# EasyEDA Pro project stm32f103VET6_开发板.eprj, board PCB1
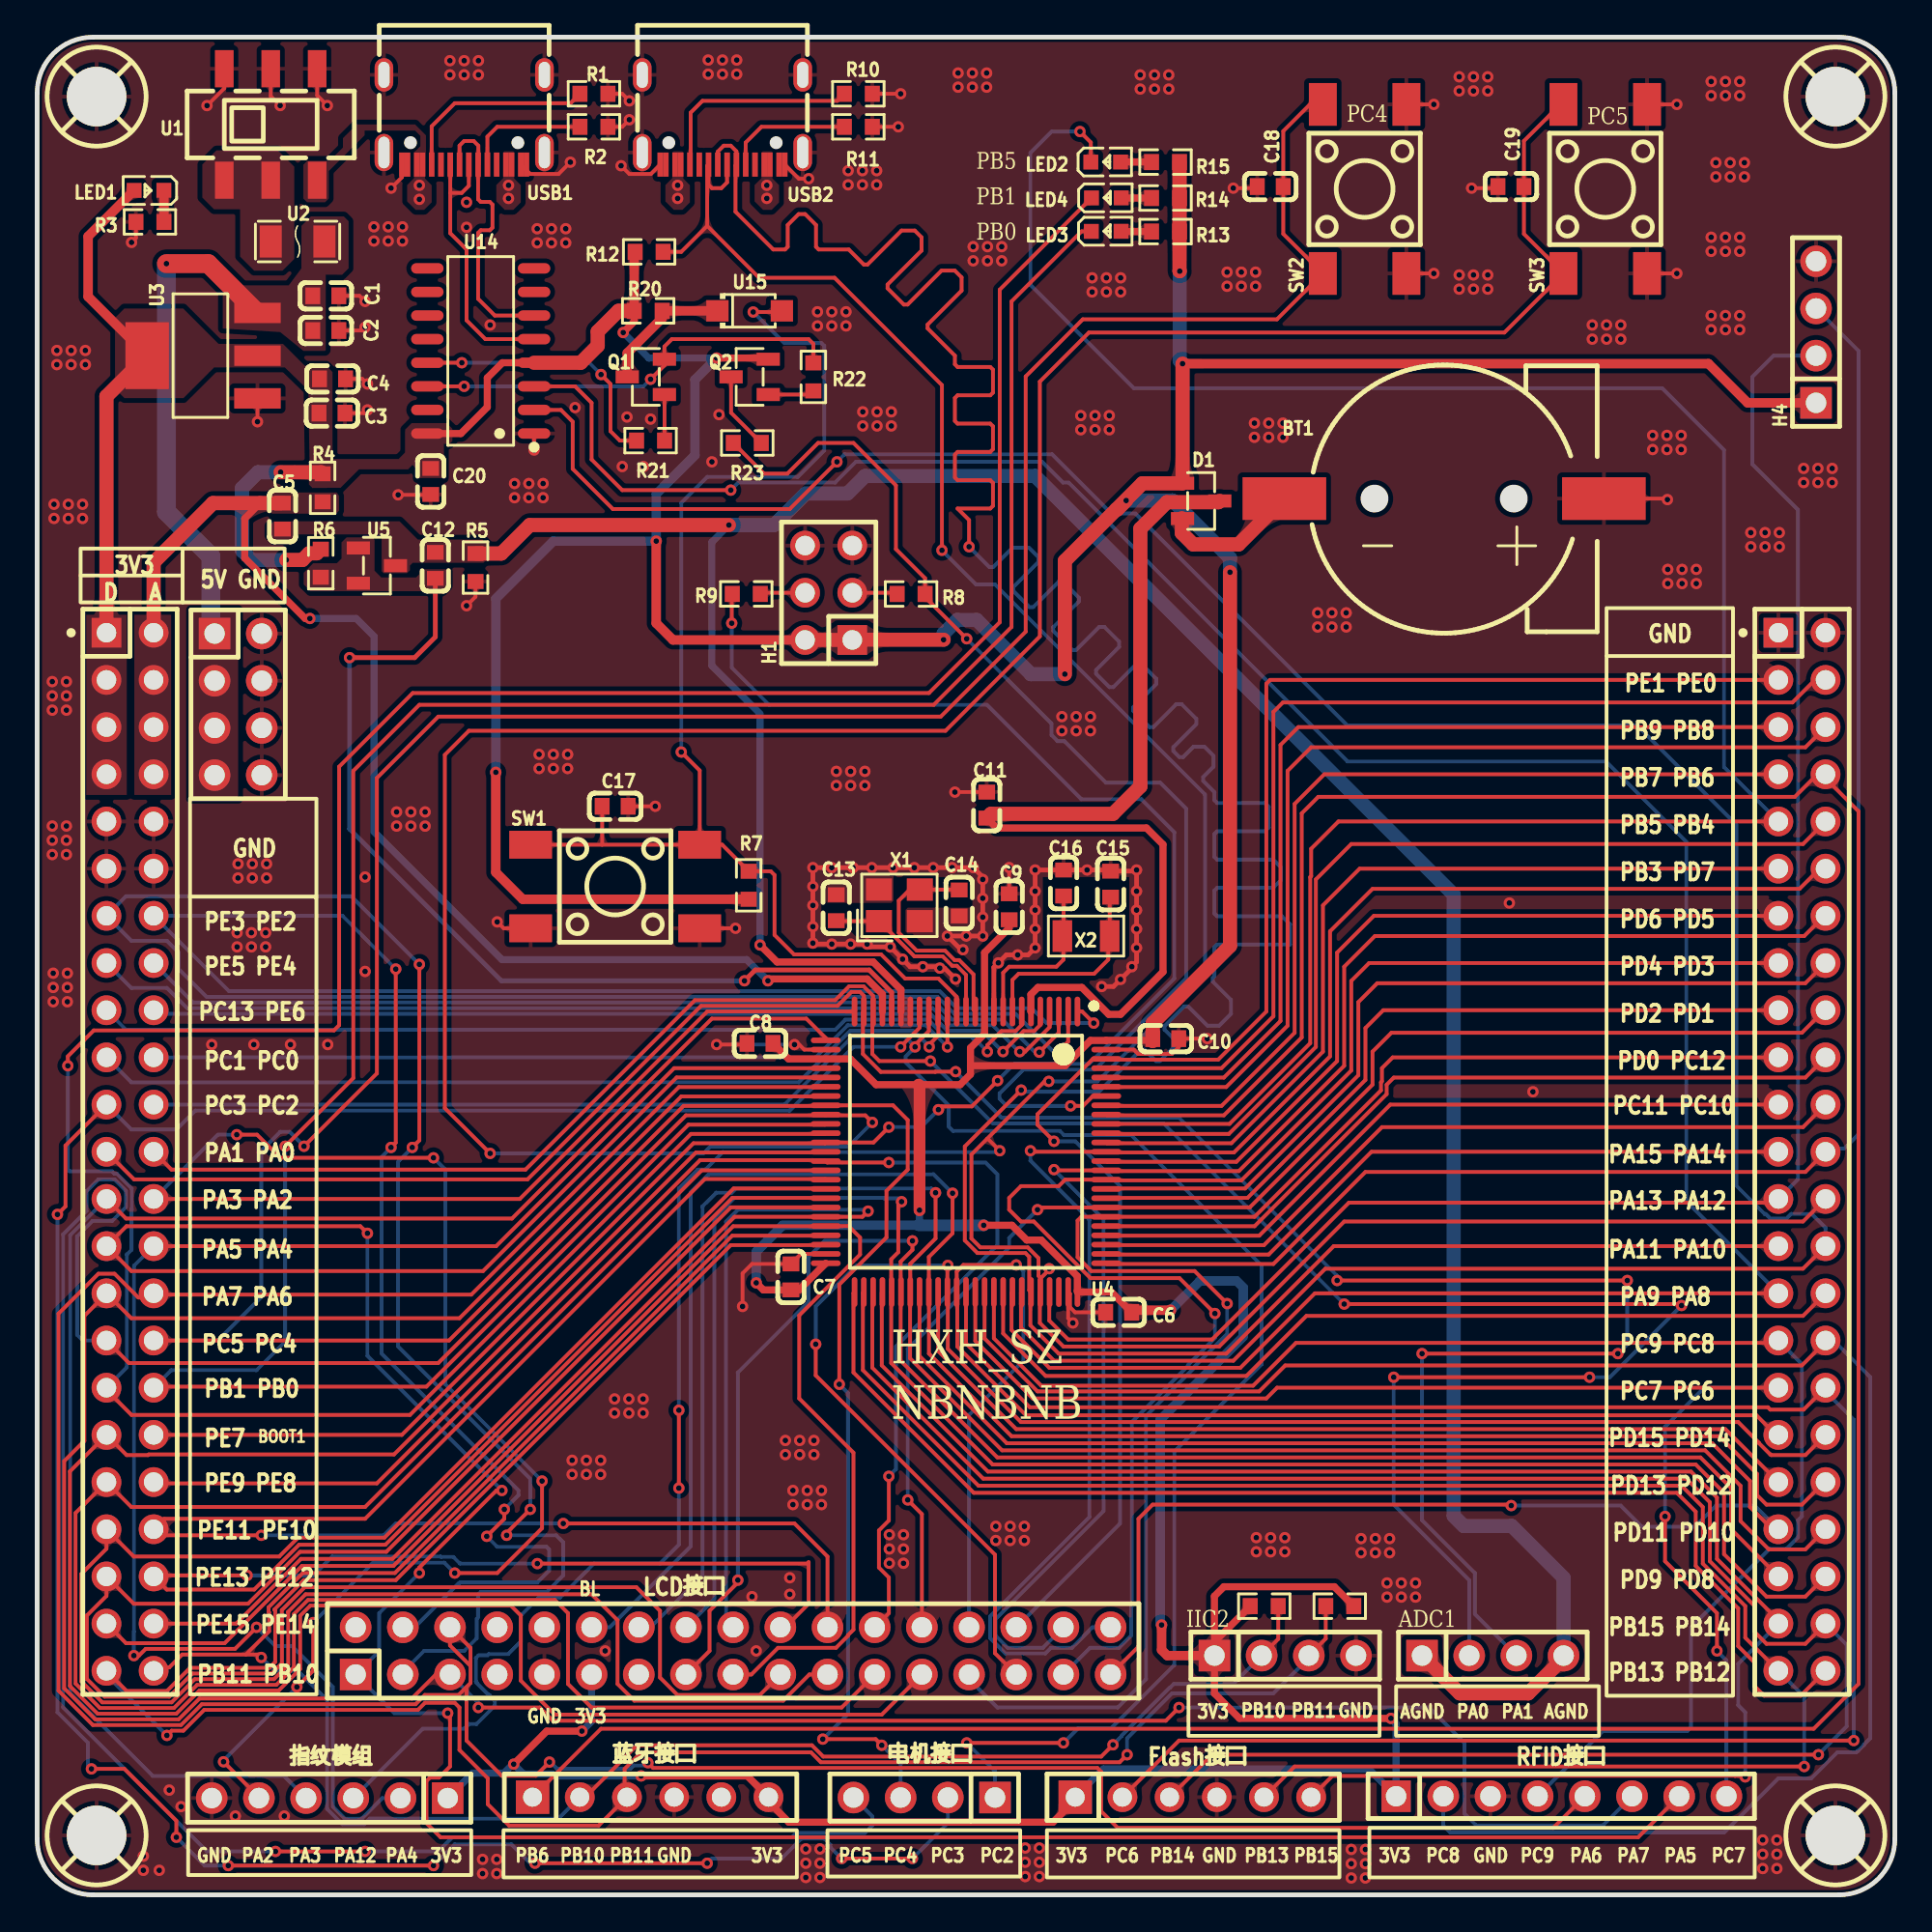
[diagram p3: board, top side]
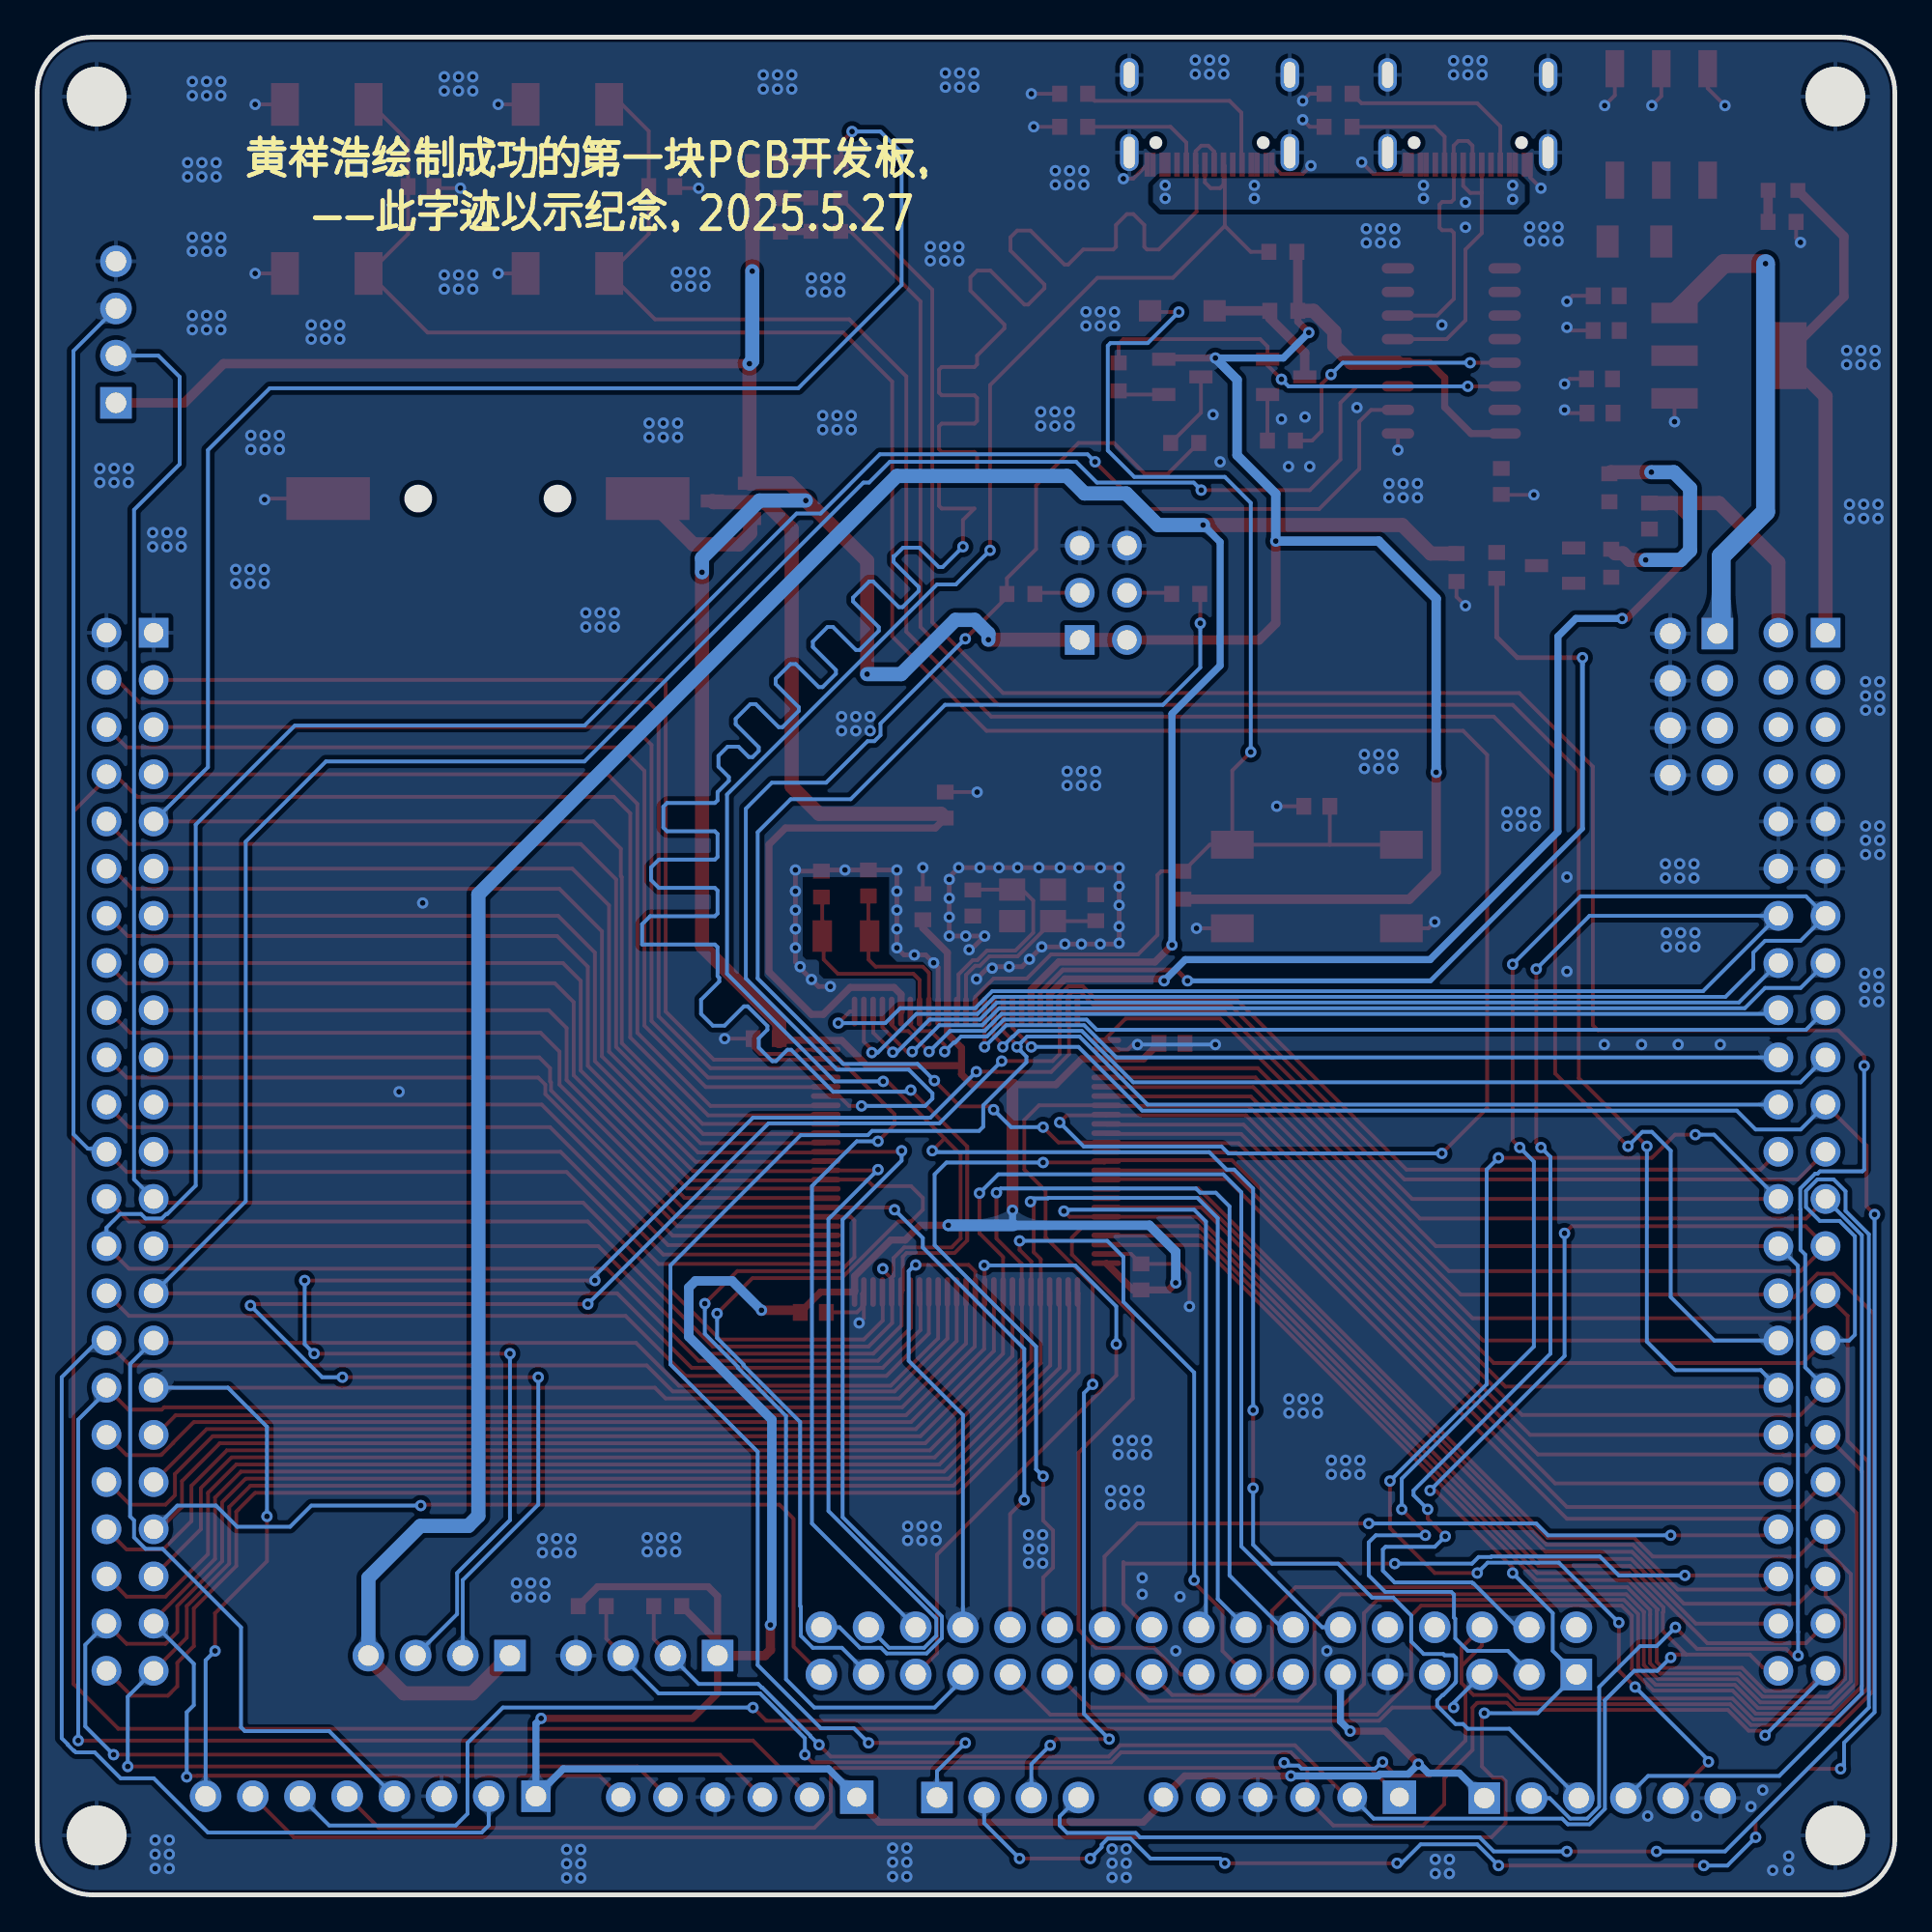
[diagram p4: board, bottom side, seen from below]

Outline 100 x 100 mm; copper layers: Top Layer, Bottom Layer. Coordinates in mm from the lower left corner of the outline.
Outline path: 0,97 0,3 arc(0.88,0.88) 3,0 97,0 arc(99.12,0.88) 100,3 100,97 arc(99.12,99.12) 97,100 3,100 arc(0.88,99.12) 0,97
Stack: Top Layer 0.035mm / Dielectric1 1.51mm FR4 er 4.5 / Bottom Layer 0.035mm

## Design rules (mm)
net PA12: DP2
net PA11: DP2
net DP: DP1
net DN: DP1
template: 自定义配置
spacing copperThickness1oz (default): track to track 0.102, other pairs 0.152 to 0.3
spacing copperThickness2oz: track to track 0.203, other pairs 0.152 to 0.3
track width copperThickness1oz (default): min 0.127, default 0.203, max 2.54
track width copperThickness2oz: min 0.203, default 0.254, max 2.54
differential pair differentialPair (default): width min 0.127, default 0.203, max 2.54; gap min 0.102, default 0.102
via viaSize (default): diameter min 0.5, default 0.61, max 10; hole min 0.3, default 0.305, max 6.3

## Placement (name value [footprint] x y rotation side)
BT1  CR1220-2ZX  [BAT-SMD_CR1220-2ZX]  75.74 75.16 180 top
C1  10uF  [C0603]  15.54 86.08 180 top
C2  100nF  [C0603]  15.54 84.21 180 top
C3  10uF  [C0603]  15.87 79.76 180 top
C4  100nF  [C0603]  15.9 81.6 180 top
C5  100nF  [C0603]  13.21 74.22 90 top
C6  100nF  [C0603]  58.22 31.36 0 top
C7  100nF  [C0603]  40.58 33.26 270 top
C8  100nF  [C0603]  38.91 45.83 0 top
C9  100nF  [C0603]  52.32 53.19 270 top
C10  100nF  [C0603]  60.75 46.09 180 top
C11  100nF  [C0603]  51.12 58.66 90 top
C12  100nF  [C0603]  21.43 71.57 270 top
C13  20pF  [C0603]  43.02 53.14 90 top
C14  20pF  [C0603]  49.63 53.39 90 top
C15  10pF  [C0603]  57.78 54.41 270 top
C16  10pF  [C0603]  55.25 54.47 270 top
C17  100nF  [C0603]  31.12 58.6 180 top
C18  100nF  [C0603]  66.38 91.96 0 top
C19  100nF  [C0603]  79.33 91.96 0 top
C20  100nF  [C0603]  21.19 76.08 270 top
D1  BAT54C  [SOT-23-3_L2.9-W1.3-P1.90-LS2.4-BR]  62.66 75.03 180 top
H1  -  [HDR-TH_6P-P2.54-V-R2-C3-S2.54_A2541WV-2X3P]  42.61 70.09 90 top
H2  X6521WV-2x23H-C60D30  [HDR-TH_46P-2.54-V-M-R2-C23-S2.54]  5 40 270 top
H3  X6521WV-2x23H-C60D30  [HDR-TH_46P-2.54-V-M-R2-C23-S2.54]  95 40 270 top
H4  -  [HDR-TH_4P-P2.54-V-M]  95.76 84.12 90 top
H5  HDR2.54-LI-2x4P  [HDR-TH_4P-P2.54-V-M]  47.75 5.24 180 top
H8  HDR2.54-LI-2x4P  [HDR-TH_4P-P2.54-V-M]  67.18 12.88 0 top
H9  HDR2.54-LI-2x4P  [HDR-TH_4P-P2.54-V-M]  78.36 12.88 0 top
LED1  -  [LED_0603]  5.97 91.75 180 top
LED2  -  [LED_0603]  57.57 93.29 0 top
LED3  -  [LED_0603]  57.6 89.55 0 top
LED4  -  [LED_0603]  57.6 91.35 0 top
P1  2.54-1*6P母  [HDR-TH_6P-P2.54-V-F]  33.02 5.26 0 top
P2  2.54-1*6P母  [HDR-TH_6P-P2.54-V-F]  62.23 5.26 0 top
Q1  S8050  [SOT-23-3_L2.9-W1.3-P1.90-LS2.4-BR]  32.77 81.71 0 top
Q2  S8550  [SOT-23-3_L2.9-W1.3-P1.90-LS2.4-BR]  38.35 81.71 0 top
R1  5.1k  [R0603]  29.97 96.95 0 top
R2  5.1k  [R0603]  29.97 95.17 0 top
R3  2K  [R0603]  6.07 90.05 0 top
R4  0  [R0603]  15.37 75.74 270 top
R5  0  [R0603]  23.6 71.45 90 top
R6  1K  [R0603]  15.27 71.68 270 top
R7  10K  [R0603]  38.3 54.35 90 top
R8  10K  [R0603]  47.04 70.03 180 top
R9  10K  [R0603]  38.17 70.03 180 top
R10  5.1k  [R0603]  44.2 96.95 0 top
R11  5.1k  [R0603]  44.2 95.17 0 top
R12  10K  [R0603]  32.94 88.44 180 top
R13  10K  [R0603]  60.74 89.53 180 top
R14  10K  [R0603]  60.74 91.34 180 top
R15  10K  [R0603]  60.74 93.28 180 top
R18  4.7K  [R0603]  66.06 15.54 180 top
R19  4.7K  [R0603]  70.12 15.54 0 top
R20  10K  [R0603]  32.89 85.27 180 top
R21  1K  [R0603]  33.02 78.28 0 top
R22  1K  [R0603]  41.78 81.71 270 top
R23  1K  [R0603]  38.23 78.16 0 top
SCREW1  -  [M3螺丝]  3.2 96.8 0 top
SCREW2  -  [M3螺丝]  96.8 96.8 0 top
SCREW3  -  [M3螺丝]  96.8 3.2 0 top
SCREW4  -  [M3螺丝]  3.2 3.2 0 top
SW1  -  [SW-SMD_4P-L6.0-W6.0-P4.50-LS9.0-2]  31.12 54.28 0 top
SW2  -  [SW-SMD_4P-L6.0-W6.0-P4.50-LS9.0-2]  71.46 91.83 90 top
SW3  -  [SW-SMD_4P-L6.0-W6.0-P4.50-LS9.0-2]  84.41 91.83 90 top
U1  YSSP2AG00  [SW-SMD_YSSP2AG00]  12.57 95.3 0 top
U2  JK-nSMD005/60V  [F1206]  14.02 89 0 top
U3  AMS1117-3.3  [SOT-223-3_L6.5-W3.4-P2.30-LS7.0-BR]  8.89 82.86 0 top
U4  STM32F103VET6  [LQFP-100_L14.0-W14.0-P0.50-LS16.0-BL]  50 40 180 top
U5  TL431  [SOT-23-3_L2.9-W1.3-P1.90-LS2.4-BR]  18.29 71.55 180 top
U12  双排,C5304剪切后双排2x17P  [HDR-TH_34P-P2.54-V-F-R2-C17-S2.54-1]  37.47 13.13 0 top
U13  B254YP-ZD08P  [HDR-TH_8P-P2.54-V-F]  82.04 5.31 0 top
U14  CH340C  [SOP-16_L10.0-W3.9-P1.27-LS6.0-BL]  23.88 83.11 90 top
U15  1N4007W  [SOD-123FL_L2.7-W1.8-LS3.7-RD]  38.35 85.27 0 top
U16  CS-1109-1*6(L11.5)  [HDR-TH_6P-P2.54-V-M]  15.75 5.21 180 top
U17  GPHA201-0402A001R1AA  [HDR-TH_8P-P2.54-V-M-R2-C4-S2.54]  10.82 64.08 270 top
USB1  HC-TYPE-C-16P-01B  [USB-C-SMD_KH-TYPE-C-16P]  22.99 95.56 180 top
USB2  HC-TYPE-C-16P-01B  [USB-C-SMD_KH-TYPE-C-16P]  36.89 95.56 180 top
X1  XL2EL89CSI-KPIYLC-8M  [CRYSTAL-SMD_4P-L3.2-W2.5-BL]  46.41 53.26 0 top
X2  -  [OSC-SMD_L3.2-W1.5]  56.46 51.61 0 top

## Footprints (pads in the part's own frame, mm; a bottom-side part is the same pattern mirrored in y, then rotated)
BAT-SMD_CR1220-2ZX
  rect 4.5x2.3 smd: 1(-8.6,0) 2(8.6,0)
C0603
  rect 0.8x0.9 smd: 1(-0.7,0) 2(0.7,0)
CRYSTAL-SMD_4P-L3.2-W2.5-BL
  rect 1.4x1.2 smd: 1(-1.1,-0.85) 2(1.1,-0.85) 3(1.1,0.85) 4(-1.1,0.85)
F1206
  rect 1.19x1.728 smd: 1(-1.445,0) 2(1.445,0)
HDR-TH_4P-P2.54-V-M
  rect 1.7x1.7 hole 1.1: 1(-3.81,0)
  round 1.7 hole 1.1: 2(-1.27,0) 3(1.27,0) 4(3.81,0)
HDR-TH_6P-P2.54-V-F
  rect 1.8x1.8 hole 1.02: 1(-6.35,0)
  round 1.6 hole 1.02: 2(-3.81,0) 3(-1.27,0) 4(1.27,0) 5(3.81,0) 6(6.35,0)
HDR-TH_6P-P2.54-V-M
  rect 1.7x1.7 hole 1.1: 1(-6.35,0)
  round 1.7 hole 1.1: 2(-3.81,0) 3(-1.27,0) 4(1.27,0) 5(3.81,0) 6(6.35,0)
HDR-TH_6P-P2.54-V-R2-C3-S2.54_A2541WV-2X3P
  rect 1.6x1.6 hole 1.05: 1(-2.54,-1.27)
  round 1.6 hole 1.05: 2(-2.54,1.27) 3(0,-1.27) 4(0,1.27) 5(2.54,-1.27) 6(2.54,1.27)
HDR-TH_8P-P2.54-V-F
  rect 1.575x1.7 hole 1.1: 1(-8.89,0)
  round 1.7 hole 1.1: 2(-6.35,0) 3(-3.81,0) 4(-1.27,0) 5(1.27,0) 6(3.81,0) 7(6.35,0) 8(8.89,0)
HDR-TH_8P-P2.54-V-M-R2-C4-S2.54
  rect 1.7x1.7 hole 1.1: 1(-3.81,-1.27)
  round 1.7 hole 1.1: 2(-3.81,1.27) 3(-1.27,-1.27) 4(-1.27,1.27) 5(1.27,-1.27) 6(1.27,1.27) 7(3.81,-1.27) 8(3.81,1.27)
HDR-TH_34P-P2.54-V-F-R2-C17-S2.54-1
  rect 1.7x1.7 hole 1.1: 1(-20.32,-1.27)
  round 1.7 hole 1.1: 2(-17.78,-1.27) 3(-15.24,-1.27) 4(-12.7,-1.27) 5(-10.16,-1.27) 6(-7.62,-1.27) 7(-5.08,-1.27) 8(-2.54,-1.27) 9(0,-1.27) 10(2.54,-1.27) 11(5.08,-1.27) 12(7.62,-1.27) 13(10.16,-1.27) 14(12.7,-1.27) 15(15.24,-1.27) 16(17.78,-1.27) 17(20.32,-1.27) 18(20.32,1.27) 19(17.78,1.27) 20(15.24,1.27) 21(12.7,1.27) 22(10.16,1.27) 23(7.62,1.27) 24(5.08,1.27) 25(2.54,1.27) 26(0,1.27) 27(-2.54,1.27) 28(-5.08,1.27) 29(-7.62,1.27) 30(-10.16,1.27) 31(-12.7,1.27) 32(-15.24,1.27) 33(-17.78,1.27) 34(-20.32,1.27)
HDR-TH_46P-2.54-V-M-R2-C23-S2.54
  rect 1.6x1.6 hole 1.05: 1(-27.94,-1.27)
  round 1.6 hole 1.05: 2(-27.94,1.27) 3(-25.4,-1.27) 4(-25.4,1.27) 5(-22.86,-1.27) 6(-22.86,1.27) 7(-20.32,-1.27) 8(-20.32,1.27) 9(-17.78,-1.27) 10(-17.78,1.27) 11(-15.24,-1.27) 12(-15.24,1.27) 13(-12.7,-1.27) 14(-12.7,1.27) 15(-10.16,-1.27) 16(-10.16,1.27) 17(-7.62,-1.27) 18(-7.62,1.27) 19(-5.08,-1.27) 20(-5.08,1.27) 21(-2.54,-1.27) 22(-2.54,1.27) 23(0,-1.27) 24(0,1.27) 25(2.54,-1.27) 26(2.54,1.27) 27(5.08,-1.27) 28(5.08,1.27) 29(7.62,-1.27) 30(7.62,1.27) 31(10.16,-1.27) 32(10.16,1.27) 33(12.7,-1.27) 34(12.7,1.27) 35(15.24,-1.27) 36(15.24,1.27) 37(17.78,-1.27) 38(17.78,1.27) 39(20.32,-1.27) 40(20.32,1.27) 41(22.86,-1.27) 42(22.86,1.27) 43(25.4,-1.27) 44(25.4,1.27) 45(27.94,-1.27) 46(27.94,1.27)
LED_0603
  rect 0.8x0.8 smd: 1(-0.851,-0.01) 2(0.75,-0.005)
LQFP-100_L14.0-W14.0-P0.50-LS16.0-BL
  oval 0.3x1.6 smd: 1(-6,-7.55) 2(-5.5,-7.55) 3(-5,-7.55) 4(-4.5,-7.55) 5(-4,-7.55) 6(-3.5,-7.55) 7(-3,-7.55) 8(-2.5,-7.55) 9(-2,-7.55) 10(-1.5,-7.55) 11(-1,-7.55) 12(-0.5,-7.55) 13(0,-7.55) 14(0.5,-7.55) 15(1,-7.55) 16(1.5,-7.55) 17(2,-7.55) 18(2.5,-7.55) 19(3,-7.55) 20(3.5,-7.55) 21(4,-7.55) 22(4.5,-7.55) 23(5,-7.55) 24(5.5,-7.55) 25(6,-7.55) 51(6,7.55) 52(5.5,7.55) 53(5,7.55) 54(4.5,7.55) 55(4,7.55) 56(3.5,7.55) 57(3,7.55) 58(2.5,7.55) 59(2,7.55) 60(1.5,7.55) 61(1,7.55) 62(0.5,7.55) 63(0,7.55) 64(-0.5,7.55) 65(-1,7.55) 66(-1.5,7.55) 67(-2,7.55) 68(-2.5,7.55) 69(-3,7.55) 70(-3.5,7.55) 71(-4,7.55) 72(-4.5,7.55) 73(-5,7.55) 74(-5.5,7.55) 75(-6,7.55)
  oval 1.6x0.3 smd: 26(7.55,-6) 27(7.55,-5.5) 28(7.55,-5) 29(7.55,-4.5) 30(7.55,-4) 31(7.55,-3.5) 32(7.55,-3) 33(7.55,-2.5) 34(7.55,-2) 35(7.55,-1.5) 36(7.55,-1) 37(7.55,-0.5) 38(7.55,0) 39(7.55,0.5) 40(7.55,1) 41(7.55,1.5) 42(7.55,2) 43(7.55,2.5) 44(7.55,3) 45(7.55,3.5) 46(7.55,4) 47(7.55,4.5) 48(7.55,5) 49(7.55,5.5) 50(7.55,6) 76(-7.55,6) 77(-7.55,5.5) 78(-7.55,5) 79(-7.55,4.5) 80(-7.55,4) 81(-7.55,3.5) 82(-7.55,3) 83(-7.55,2.5) 84(-7.55,2) 85(-7.55,1.5) 86(-7.55,1) 87(-7.55,0.5) 88(-7.55,0) 89(-7.55,-0.5) 90(-7.55,-1) 91(-7.55,-1.5) 92(-7.55,-2) 93(-7.55,-2.5) 94(-7.55,-3) 95(-7.55,-3.5) 96(-7.55,-4) 97(-7.55,-4.5) 98(-7.55,-5) 99(-7.55,-5.5) 100(-7.55,-6)
M3螺丝
  round 3.2 hole 3.2: 1(0,0)
OSC-SMD_L3.2-W1.5
  rect 1.05x1.7 smd: 1(-1.275,0) 2(1.275,0)
R0603
  rect 0.806x0.864 smd: 1(-0.753,0) 2(0.753,0)
SOD-123FL_L2.7-W1.8-LS3.7-RD
  rect 1.2x1.15 smd: 1(-1.735,0) 2(1.735,0)
SOP-16_L10.0-W3.9-P1.27-LS6.0-BL
  oval 0.56x1.745 smd: 1(-4.445,-2.873) 2(-3.175,-2.873) 3(-1.905,-2.873) 4(-0.635,-2.873) 5(0.635,-2.873) 6(1.905,-2.873) 7(3.175,-2.873) 8(4.445,-2.873) 9(4.445,2.873) 10(3.175,2.873) 11(1.905,2.873) 12(0.635,2.873) 13(-0.635,2.873) 14(-1.905,2.873) 15(-3.175,2.873) 16(-4.445,2.873)
SOT-23-3_L2.9-W1.3-P1.90-LS2.4-BR
  rect 1.25x0.7 smd: 1(1,-0.95) 2(1,0.95) 3(-1,0)
SOT-223-3_L6.5-W3.4-P2.30-LS7.0-BR
  rect 2.5x1.1 smd: 1(2.97,-2.3) 2(2.97,0) 3(2.97,2.3)
  rect 2.34x3.6 smd: 4(-2.97,0)
SW-SMD_4P-L6.0-W6.0-P4.50-LS9.0-2
  rect 2.3x1.5 smd: 1(-4.55,2.25) 2(4.55,2.25) 3(-4.55,-2.25) 4(4.55,-2.25)
SW-SMD_YSSP2AG00
  rect 1x2 smd: 1(-2.5,3) 2(0,3) 3(2.5,3) 4(-2.5,-3) 5(0,-3) 6(2.5,-3)
USB-C-SMD_KH-TYPE-C-16P
  oval 1x2 hole 0.6x1.7: 1(-4.32,1.765) 2(4.32,1.765)
  oval 1x1.8 hole 0.6x1.4: 3(-4.32,-2.415) 4(4.32,-2.415)
  rect 0.3x1.3 smd: A1(-3.35,2.415) A4(-2.55,2.415) A5(-1.25,2.415) A6(-0.25,2.415) A7(0.25,2.415) A8(1.25,2.415) A9(2.55,2.415) A12(3.35,2.415) B1(3.05,2.415) B4(2.25,2.415) B5(1.75,2.415) B6(0.75,2.415) B7(-0.75,2.415) B8(-1.75,2.415) B9(-2.25,2.415) B12(-3.05,2.415)

## Nets
As in the schematic.

Pads without a net: P1 5; U4 73; U12 4 7 30 31 34; U14 7 8 9 10 11 12 15; USB1 A8 B8; USB2 A8 B8

## Via types
v1: diameter 0.61, hole 0.305, Top Layer to Bottom Layer, 579 vias

## Routing (per net, layer and track width the routed paths; a pad name or vN(x,y) marks a point on that pad's centre or on a via; arc(x,y) is an arc through that point)
AGND: length 151.8
  Top Layer w0.381: v1(38.91,51.13) 39.83,50.22 45.01,50.22 46.5,48.72 U4.20
  Top Layer w0.762: H9.4 82.17,12.75 80.26,10.85 76.58,10.85 H9.1 ; R5.2 24.98,72.2 26.52,73.74 v1(37.24,73.74)
  Bottom Layer w0.381: v1(38.91,51.13) 38.91,63.58 36.32,66.17 36.32,72.82 v1(37.24,73.74)
  Bottom Layer w0.762: H9.4 82.17,17.06 79.38,19.86 76.79,19.86 76.25,20.4 76.25,53.85 53.72,76.38 44.56,76.38 43.62,75.44 41.38,75.44 39.68,73.74 v1(37.24,73.74)
GND: length 129.5
  Top Layer w0.203: v1(23.11,69.39) 23.6,69.88 R5.1 ; v1(87.76,75.11) 87.7,75.16 BT1.1 ; SW3.4 v1(88.26,96.38) ; R10.2 v1(46.48,96.95) ; v1(24.77,52.38) 25.11,52.03 26.56,52.03 ; v1(13.08,96.32) 12.57,96.83 U1.2 ; SW2.3 v1(75.18,87.28) ; C1.1 17.35,86.08 v1(17.65,85.78) ; R1.2 31.5,96.95 v1(31.88,96.57) ; C17.1 v1(33.27,58.6) ; v1(77.22,91.87) 78.55,91.87 C19.1 ; v1(19.43,75.36) 21.16,75.36 C20.2 ; USB2.A1 41,92.38 v1(41.53,92.38) ; USB1.B12 26.54,92.63 28.07,92.63 v1(28.7,93.27) ; R2.2 31.5,95.17 v1(31.88,95.56) ; 38.21,45.83 38.15,45.77 v1(36.58,45.77) ; v1(9.14,96.32) 10.07,97.25 U1.1 ; v1(31.43,93.08) 31.88,92.63 33.03,92.63 USB2.A12 ; v1(40.77,45.77) 41.02,45.77 41.29,45.5 U4.27 ; R3.1 5.32,89.19 v1(5.08,88.95) ; v1(55.75,30.78) 55.5,31.04 U4.74 55.6,32.35 55.6,31.63 55.87,31.36 57.52,31.36 ; v1(19.05,91.87) 19.64,92.46 USB1.A12 ; v1(37.97,31.67) 37.97,33.45 38.48,33.96 C7.1 41.12,34.5 U4.49 ; v1(49.4,59.36) 49.41,59.36 C11.2 ; 35.66,52.03 v1(37.59,52.03) ; v1(17.78,79.93) 17.61,79.76 C3.1 ; v1(62.99,46.09) C10.1 61.45,45.63 61.09,45.27 59.27,45.27 59.03,45.5 U4.99 ; v1(17.65,84.38) 17.48,84.21 C2.1 ; U1.3 15.07,96.87 v1(15.62,96.32) ; v1(17.78,81.33) 17.51,81.6 C4.1 ; v1(64.39,91.87) 65.59,91.87 C18.1 ; SW3.3 v1(88.26,87.28) ; C9.1 v1(52.32,55.3) ; U14.1 v1(26.75,77.78) ; SW2.4 v1(75.18,96.38) ; U3.1 v1(11.86,79.3) ; R11.2 v1(46.35,95.17)
  Top Layer w0.254: v1(57.3,48.9) 57.94,48.9 v1(58.32,49.28) 58.93,49.89 v1(58.93,49.96) 59.18,50.22 v1(59.18,50.98) v1(59.18,51.99) v1(59.18,53.01) v1(59.18,54.03) v1(59.18,55.17) 59.12,55.11 C15.1 57.72,55.17 v1(56.51,55.17) C16.1 v1(53.72,55.17) v1(53.72,54.03) v1(53.72,53.01) v1(53.72,51.99) v1(53.72,50.98) 53.34,50.6 v1(52.78,50.6) 52.17,50.6 v1(51.74,50.17) 51.5,49.93 U4.10 ; v1(49.84,50.88) 49.73,50.88 v1(49,51.61) v1(50.01,51.61) v1(50.9,51.61) v1(50.9,52.63) v1(50.9,53.64) v1(50.9,54.66) 50.9,54.79 v1(50.39,55.3) v1(49.25,55.3) v1(48.23,55.3) v1(47.22,55.3) v1(46.08,55.3) v1(44.93,55.3) v1(43.92,55.3) v1(42.77,55.3) v1(41.76,55.3) v1(41.76,54.28) v1(41.76,53.26) v1(41.76,52.12) v1(41.76,51.23) 41.81,51.18 v1(42.77,51.18) v1(43.79,51.18) v1(44.68,51.18) 44.83,51.03 v1(45.92,51.03) v1(46.59,50.37) 46.99,49.96 v1(47.68,49.96) 48.51,49.96 v1(48.59,49.89) 48.84,49.89 v1(49.43,49.3)
  Bottom Layer w0.203: v1(40.77,45.77) v1(36.58,45.77)
  vias: v1(0.81,65.31) v1(0.81,64.54) v1(0.81,63.77) v1(0.81,57.54) v1(0.81,56.77) v1(0.81,56) v1(0.91,74.85) v1(0.91,74.09) v1(0.86,49.61) v1(0.86,48.84) v1(0.86,48.08) v1(1.06,83.13) v1(1.06,82.37) v1(1.58,65.31) v1(1.58,64.54) v1(1.58,63.77) v1(1.58,57.54) v1(1.58,56.77) v1(1.58,56) v1(1.63,49.61) v1(1.63,48.84) v1(1.63,48.08) v1(1.68,74.85) v1(1.68,74.09) v1(1.83,83.13) v1(1.83,82.37) v1(2.44,74.85) v1(2.44,74.09) v1(2.6,83.13) v1(2.6,82.37) v1(5.72,2.08) v1(5.72,1.32) v1(6.57,1.32) v1(7.11,5.64) v1(7.75,4.75) v1(9.4,45.77) v1(10.67,4.24) v1(10.81,55.5) v1(10.81,54.74) v1(10.76,51.79) v1(10.76,51.03) v1(11.53,51.79) v1(11.53,51.03) v1(11.58,55.5) v1(11.58,54.74) v1(11.66,45.77) v1(12.35,55.5) v1(12.35,54.74) v1(12.3,51.79) v1(12.3,51.03) v1(13.31,4.24) v1(13.64,45.77) v1(15.64,45.77) v1(17.65,54.79) v1(17.65,49.71) v1(18.13,89.79) v1(18.13,89.03) v1(18.9,89.79) v1(18.9,89.03) v1(19.35,58.29) v1(19.35,57.53) v1(19.67,89.79) v1(19.67,89.03) v1(20.12,58.29) v1(20.12,57.53) v1(20.88,58.29) v1(20.88,57.53) v1(22.22,98.73) v1(22.22,97.97) v1(22.99,98.73) v1(22.99,97.97) v1(23.11,89.76) v1(23.75,98.73) v1(23.75,97.97) v1(23.98,1.91) v1(23.98,1.14) v1(24.38,84.51) v1(24.74,1.91) v1(24.74,1.14) v1(25.7,75.97) v1(25.7,75.21) v1(26.47,75.97) v1(26.47,75.21) v1(26.92,89.69) v1(26.92,88.93) v1(27.02,61.39) v1(27.02,60.63) v1(27.23,75.97) v1(27.23,75.21) v1(27.69,89.69) v1(27.69,88.93) v1(27.79,61.39) v1(27.79,60.63) v1(28.45,89.69) v1(28.45,88.93) v1(28.56,61.39) v1(28.56,60.63) v1(28.8,23.39) v1(28.8,22.63) v1(28.96,80.06) v1(29.57,23.39) v1(29.57,22.63) v1(30.33,23.39) v1(30.33,22.63) v1(30.58,13.13) v1(31.08,26.7) v1(31.08,25.93) v1(31.5,76.89) v1(31.75,79.55) v1(31.85,26.7) v1(31.85,25.93) v1(32.64,76.89) v1(32.62,26.7) v1(32.62,25.93) v1(33.02,79.44) v1(36.12,98.77) v1(36.12,98.01) v1(36.32,77.14) v1(36.7,79.68) v1(36.89,98.77) v1(36.89,98.01) v1(37.66,98.77) v1(37.66,98.01) v1(38.48,16.05) v1(38.71,13.13) v1(40.28,24.46) v1(40.28,23.7) v1(40.51,17.07) v1(40.51,16.18) v1(40.68,21.77) v1(40.68,21.01) v1(41.05,24.46) v1(41.05,23.7) v1(41.38,2.47) v1(41.38,1.7) v1(41.38,0.93) v1(41.45,21.77) v1(41.45,21.01) v1(41.81,24.46) v1(41.81,23.7) v1(42,85.22) v1(42,84.45) v1(42.14,2.47) v1(42.14,1.7) v1(42.14,0.93) v1(42.22,21.77) v1(42.22,21.01) v1(42.77,85.22) v1(42.77,84.45) v1(43.02,60.48) v1(43.02,59.72) v1(43.54,85.22) v1(43.54,84.45) v1(43.66,92.81) v1(43.66,92.05) v1(43.79,60.48) v1(43.79,59.72) v1(44.42,92.81) v1(44.42,92.05) v1(44.44,79.83) v1(44.44,79.07) v1(44.56,60.48) v1(44.56,59.72) v1(45.19,92.81) v1(45.19,92.05) v1(45.21,79.83) v1(45.21,79.07) v1(45.87,19.39) v1(45.87,18.62) v1(45.87,17.85) v1(45.98,79.83) v1(45.98,79.07) v1(46.63,19.39) v1(46.63,18.62) v1(46.63,17.85) v1(49.57,98.07) v1(49.57,97.31) v1(50.34,98.07) v1(50.34,97.31) v1(50.39,88.72) v1(50.39,87.96) v1(51.11,98.07) v1(51.11,97.31) v1(51.16,88.72) v1(51.16,87.96) v1(51.61,19.84) v1(51.61,19.08) v1(51.92,88.72) v1(51.92,87.96) v1(52.38,19.84) v1(52.38,19.08) v1(53.14,19.84) v1(53.14,19.08) v1(53.19,2.52) v1(53.19,1.75) v1(53.19,0.98) v1(53.95,2.52) v1(53.95,1.75) v1(53.95,0.98) v1(55.16,63.42) v1(55.16,62.66) v1(55.93,63.42) v1(55.93,62.66) v1(56.18,79.63) v1(56.18,78.87) v1(56.7,63.42) v1(56.7,62.66) v1(56.79,87.05) v1(56.79,86.28) v1(56.95,79.63) v1(56.95,78.87) v1(57.56,87.05) v1(57.56,86.28) v1(57.71,79.63) v1(57.71,78.87) v1(58.32,87.05) v1(58.32,86.28) v1(59.38,97.97) v1(59.38,97.21) v1(60.15,97.97) v1(60.15,97.21) v1(60.91,97.97) v1(60.91,97.21) v1(64.05,87.35) v1(64.05,86.59) v1(64.82,87.35) v1(64.82,86.59) v1(65.53,79.22) v1(65.53,78.46) v1(65.59,87.35) v1(65.59,86.59) v1(65.63,19.23) v1(65.63,18.47) v1(66.29,79.22) v1(66.29,78.46) v1(66.4,19.23) v1(66.4,18.47) v1(67.06,79.22) v1(67.06,78.46) v1(67.16,19.23) v1(67.16,18.47) v1(68.93,69.01) v1(68.93,68.25) v1(69.7,69.01) v1(69.7,68.25) v1(70.47,69.01) v1(70.47,68.25) v1(70.74,2.44) v1(70.74,1.68) v1(70.74,0.91) v1(71.27,19.18) v1(71.27,18.41) v1(71.5,2.44) v1(71.5,1.68) v1(71.5,0.91) v1(72.03,19.18) v1(72.03,18.41) v1(72.66,16.79) v1(72.66,16.03) v1(72.8,19.18) v1(72.8,18.41) v1(73.43,16.79) v1(73.43,16.03) v1(74.2,16.79) v1(74.2,16.03) v1(76.55,97.87) v1(76.55,97.1) v1(76.55,87.2) v1(76.55,86.44) v1(77.32,97.87) v1(77.32,97.1) v1(77.32,87.2) v1(77.32,86.44) v1(78.09,97.87) v1(78.09,97.1) v1(78.09,87.2) v1(78.09,86.44) v1(79.25,53.39) v1(80.52,43.23) v1(83.71,84.51) v1(83.71,83.74) v1(84.48,84.51) v1(84.48,83.74) v1(85.25,84.51) v1(85.25,83.74) v1(86.96,78.56) v1(86.96,77.8) v1(87.73,78.56) v1(87.73,77.8) v1(87.78,71.35) v1(87.78,70.59) v1(88.5,78.56) v1(88.5,77.8) v1(88.54,71.35) v1(88.54,70.59) v1(89.31,71.35) v1(89.31,70.59) v1(90.11,97.61) v1(90.11,96.85) v1(90.11,89.23) v1(90.11,88.47) v1(90.11,85.01) v1(90.11,84.25) v1(90.37,93.24) v1(90.37,92.48) v1(90.88,97.61) v1(90.88,96.85) v1(90.88,89.23) v1(90.88,88.47) v1(90.88,85.01) v1(90.88,84.25) v1(91.13,93.24) v1(91.13,92.48) v1(91.65,97.61) v1(91.65,96.85) v1(91.65,89.23) v1(91.65,88.47) v1(91.65,85.01) v1(91.65,84.25) v1(91.9,93.24) v1(91.9,92.48) v1(92.25,73.33) v1(92.25,72.57) v1(92.89,2.95) v1(92.89,2.19) v1(92.89,1.42) v1(93.01,73.33) v1(93.01,72.57) v1(93.65,2.95) v1(93.65,2.19) v1(93.65,1.42) v1(93.78,73.33) v1(93.78,72.57) v1(95.09,76.78) v1(95.09,76.02) v1(95.86,76.78) v1(95.86,76.02) v1(96.63,76.78) v1(96.63,76.02)
VCC+5V: length 27
  Top Layer w1.016: v1(6.96,87.81) 9.21,87.81 U3.3
  Bottom Layer w1.016: v1(6.96,87.81) 6.96,74.45 9.35,72.06 9.35,68.1 U17.1
VCCA+3.3V: length 66.6
  Top Layer w0.381: v1(39.34,49.2) 39.44,49.3 44.68,49.3 45.5,48.48 U4.22 ; v1(14.68,68.71) 14.43,68.71 11.18,71.96 11.18,74.09 12,74.92
  Top Layer w0.762: C5.2 9.46,74.92 6.27,71.73 H2.2
  Bottom Layer w0.381: v1(14.68,68.71) 17.17,68.71 18.14,67.74 18.14,57.23 25.02,50.34 38.2,50.34 v1(39.34,49.2)
ADC_IN0: length 129.5
  Top Layer w0.203: H2.24 7.23,39.04 26.29,39.04 35.41,48.16 42.96,48.16 43.71,48.91 44.49,48.91 45,48.4 U4.23 44.96,47.51 44.96,45.26 45.34,44.88 v1(48.08,44.88) ; v1(83.57,27.86) v1(73.03,27.86) ; v1(88.52,31.72) 88.44,31.8 v1(70.36,31.8)
  Bottom Layer w0.203: v1(83.57,27.86) 84.66,27.86 v1(88.52,31.72) ; v1(48.08,44.88) 51.44,41.53 60.63,41.53 v1(70.36,31.8) ; H9.2 77.09,16.94 73.03,21.01 v1(73.03,27.86)
ADC_IN1: length 128.2
  Top Layer w0.203: v1(69.98,33.07) v1(85.6,33.07) ; v1(49.44,44.31) 48.35,44.31 48.34,44.3 45.41,44.3 44.45,45.26 44.45,47.5 U4.24 44.5,48.4 44.3,48.6 43.83,48.6 43.08,47.86 35.74,47.86 26.4,38.51 5.22,38.51 H2.23 ; v1(85.09,29.13) v1(74.55,29.13)
  Bottom Layer w0.203: 79.63,12.88 77.39,15.11 77.39,17.32 74.55,20.17 v1(74.55,29.13) ; v1(85.6,33.07) 85.6,29.64 v1(85.09,29.13) ; v1(69.98,33.07) 69.98,33.33 61.47,41.83 51.92,41.83 v1(49.44,44.31)
BOOT0: length 65
  Top Layer w0.203: v1(55.63,42.47) 56.3,42.47 56.83,43 U4.94 ; R23.1 39.12,76.5 40.39,76.5 42.04,78.16 43.94,78.16 46.23,75.87 46.23,72.44 47.8,70.87 R8.1 47.8,69.86 v1(50.04,67.61)
  Bottom Layer w0.203: v1(55.63,42.47) 52.2,42.47 51.81,42.86 51.81,43.15 53.09,44.42 56.95,44.42 61.85,49.33 61.85,58.47 60.45,59.87 57.53,59.87 55.3,62.1 54.93,62.1 54.6,62.43 54.6,63.05 v1(50.04,67.61)
BOOT1: length 104.5
  Top Layer w0.203: H2.36 19.63,24.76 35.33,40.46 42.41,40.46 U4.37 45.02,40.5 v1(45.85,41.33) ; v1(48.51,42.27) 48.69,42.44 50.31,42.44 v1(51.7,43.83) ; v1(37.39,68.45) 37.39,70 37.42,70.03
  Bottom Layer w0.203: v1(51.7,43.83) 52.6,44.73 56.62,44.73 61.21,49.33 61.21,57.2 59.44,58.98 56.21,58.98 51.13,64.06 39.4,64.06 37.39,66.07 v1(37.39,68.45) ; v1(45.85,41.33) 47.57,41.33 v1(48.51,42.27)
BT_3V3: length 440.7
  Top Layer w0.381: U4.50 41.01,32.56 C7.2 39.09,32.56 v1(38.71,32.94) ; U14.16 22.81,78.66 24.23,80.09 24.23,81.66 25.04,82.47 U14.4 ; v1(25.65,7.04) 27.43,8.81 v1(29.32,8.81) ; R20.2 32.14,84.69 v1(31.55,84.1) ; 50.24,44.63 50.24,45.59 51,46.35 U4.11 51,50.72 52.32,52.05 C9.2 ; 50.24,44.63 55.34,44.63 56.7,45.99 57.54,45.99 U4.100 60.05,46 ; 50.24,44.63 50.24,44.17 49.68,43.61 45.16,43.61 43.77,45 U4.28 40.45,45 C8.2 ; v1(36.58,82.73) 39.29,82.73 Q2.2 ; C6.2 57.82,32.45 U4.75 56,32.52 55.99,32.53 55.99,33.3 54.05,35.25 53.27,35.25 52.48,36.04 v1(50.95,36.04) ; H8.1 63.37,10.85 64.72,9.5 v1(72.87,9.5) ; v1(32.51,6.4) 38.23,6.4 P1.6 39.37,5 40.46,3.91 54.69,3.91 55.88,5.11 P2.1 ; R19.2 69.83,16.59 63.88,16.59 63.37,16.08 63.37,13.61 R18.2
  Top Layer w0.508: LED1.2 2.74,89.27 2.74,86.03 U3.4 ; R20.2 32.14,88.39 R12.2 ; C6.2 59.03,31.47 v1(61.01,31.47) ; v1(33.32,72.87) 33.32,68.45 34.23,67.55 H1.2 ; v1(24.69,60.43) 24.69,55.04 26.14,53.59 R7.1 ; H8.1 60.83,12.88 60.53,13.18 v1(60.53,14.53) ; v1(61.66,82.42) 89.97,82.42 92.07,80.31 H4.1
  Top Layer w0.635: v1(47.5,36.86) 47.5,43.56 47.45,43.61
  Top Layer w0.762: v1(13.41,71.86) 14.28,71.86 14.64,72.22 15.05,72.22 R6.1 ; H1.2 H1.1 43.89,67.56 v1(48.79,67.56) ; 58.09,74.58 59.5,75.98 D1.1 v1(61.66,82.42) ; 58.09,74.58 58.14,74.58 v1(58.62,75.06) ; 58.09,74.58 55.32,71.81 v1(55.32,65.71) ; v1(13.11,76.58) 15.28,76.58 R4.1 ; 60.05,45.96 60.04,45.98 60.04,45.98 60.05,46 60.05,46.92 64.21,51.08 v1(64.21,71.2) ; R15.1 R14.1 R13.1 61.49,87.41 v1(61.5,87.4) ; U14.4 29.26,82.47 30.18,83.39 30.18,84.15 31.29,85.27 R20.2 ; U3.4 3.73,80.67 H2.1
  Bottom Layer w0.381: v1(32.51,6.4) 27.81,6.4 27.71,6.5 26.19,6.5 v1(25.65,7.04) 25.6,7.04 25.12,6.55 23.44,6.55 U16.1 ; P2.1 57.4,6.78 71.68,6.78 U13.1 73.15,9.22 v1(72.87,9.5) ; v1(29.32,8.81) 29.84,9.34 U12.6 ; v1(36.58,82.73) 32.92,82.73 v1(31.55,84.1) ; 47.45,36.04 47.5,36.09 v1(47.5,36.86)
  Bottom Layer w0.508: v1(60.53,14.53) 60.45,14.6 60.45,25.58 64.92,30.05 64.92,32.69 64.56,33.05 62.59,33.05 v1(61.01,31.47) ; 47.45,36.04 40.13,36.04 38.71,34.62 v1(38.71,32.94) ; v1(36.58,82.73) 35.41,81.56 35.41,77.5 33.32,75.41 v1(33.32,72.87) 27.79,72.87 24.69,69.77 v1(24.69,60.43)
  Bottom Layer w0.635: 47.45,36.04 v1(50.95,36.04)
  Bottom Layer w0.762: v1(55.32,65.71) 53.49,65.71 50.57,68.63 49.53,68.63 48.79,67.89 v1(48.79,67.56) ; v1(64.21,71.2) 64.21,71.96 61.11,75.06 v1(58.62,75.06) ; v1(13.11,76.58) 11.89,76.58 11.02,75.72 11.02,72.36 11.53,71.86 v1(13.41,71.86) ; v1(61.5,87.4) 61.5,82.58 v1(61.66,82.42)
BT_KEY: length 177.1
  Top Layer w0.203: 96.05,60.32 H3.8 ; 96.05,60.32 98.04,58.33 98.04,11.35 95.63,8.94 30.35,8.94 P1.1 ; 96.05,60.32 95.83,60.32 94.62,59.11 68.96,59.11 68.07,58.22 68.07,46.15 63.88,41.96 57.59,41.96 U4.92
BT_RXD: length 115.9
  Top Layer w0.203: 11.23,12.94 11.91,12.94 v1(12.06,12.78) ; 11.23,12.94 12.49,14.19 12.49,15.2 12.46,15.23 12.46,15.48 14.3,17.32 19.25,17.32 37.41,35.48 42.43,35.48 U4.47 ; 11.23,12.94 7.81,12.94 7.11,12.24 6.45,12.24 H2.46 ; H8.2 66.81,13.77 R18.1 ; v1(57.91,8.08) 57.28,7.44 42.32,7.44 41.71,8.05 32.29,8.05 29.5,5.26 P1.2
  Bottom Layer w0.203: H8.2 64.39,11.35 61.19,11.35 60.99,11.15 60.96,11.15 58.37,8.56 58.37,8.53 v1(57.91,8.08) ; v1(12.06,12.78) 12.78,12.06 14.03,12.06 15.61,10.48 15.61,4.62 16.43,3.8 17.6,3.8 17.91,4.1 28.06,4.1 P1.2
BT_TXD: length 131.7
  Top Layer w0.203: H2.45 4.82,10.97 6.98,10.97 8.23,12.22 12.5,12.22 12.81,12.54 12.81,15.3 12.76,15.35 14.35,16.94 19.3,16.94 37.34,34.98 42.43,34.98 U4.48 ; H8.3 69.37,13.79 R19.1 ; v1(6.98,8.58) 7.24,8.84 7.87,8.84 8.99,9.96 20.5,9.96 20.88,10.34 22.48,10.34 22.73,10.08 22.73,7.8 24.26,6.27 24.26,4.88 25.4,3.73 30.23,3.73 P1.3 31.62,5.38 31.62,6.78 32.51,7.67 41.66,7.67 42.19,7.14 58.27,7.14 v1(58.67,7.54)
  Bottom Layer w0.203: v1(58.67,7.54) 58.67,8.43 61.09,10.85 66.55,10.85 68.45,12.75 H8.3 ; v1(6.98,8.58) 3.73,11.84 H2.45
CC11: length 6.8
  Top Layer w0.203: R11.1 38.99,95.17 38.14,94.33 USB2.A5
CC12: length 11.5
  Top Layer w0.203: USB2.B5 35.18,93.18 35.18,95.94 35.81,96.57 43.07,96.57 R10.1
CC21: length 6.7
  Top Layer w0.203: USB1.A5 24.24,94.65 24.77,95.17 R2.1
CC22: length 10.8
  Top Layer w0.203: R1.1 28.71,96.44 22.48,96.44 21.24,95.2 USB1.B5
DN: length 15.1
  Top Layer w0.203: U14.6 24.64,85.01 23.74,85.92 23.74,89.46 23.88,89.61 24.37,89.61 24.51,89.75 24.51,90.99 24.37,91.13 23.88,91.13 23.74,91.27 USB1.B7 23.75,93.15 23.75,94.16 23.5,94.41 22.99,94.41 22.74,94.16 USB1.A7
DP: length 15.1
  Top Layer w0.203: 22.24,91.62 22.24,89.45 23.11,88.57 23.11,84.76 24.13,83.74 U14.5 ; 22.24,91.62 22.86,91.62 23.24,92 USB1.A6 ; 22.24,91.62 USB1.B6
DTR: length 14.5
  Top Layer w0.203: R21.1 31.37,78.28 30.86,78.79 30.86,81.33 v1(30.35,81.84) ; U14.13 v1(22.86,82.47)
  Bottom Layer w0.203: v1(30.35,81.84) 29.72,82.47 v1(22.86,82.47)
LCD_BL: length 103.1
  Top Layer w0.203: v1(49.28,37.77) 49.28,35.61 48,34.33 U4.59 48.01,32.44 48.01,29.13 52.45,24.69 90.55,24.69 92.58,22.66 92.58,21.51 93.09,21.01 95,21.01 96.21,22.22 H3.38
  Bottom Layer w0.203: U12.29 30.82,14.4 35.18,18.76 35.18,37.82 36.14,38.79 48.26,38.79 v1(49.28,37.77)
LCD_CS: length 90.3
  Top Layer w0.203: v1(53.47,40.06) 53.52,40 U4.88 57.59,39.96 64.42,39.96 69.6,45.14 69.6,51.87 71.88,54.15 94.87,54.15 95.96,55.24 H3.12
  Bottom Layer w0.203: v1(53.47,40.06) 53.47,39.52 56.64,36.34 56.64,20.33 51.3,14.99 51.3,13.82 52.12,12.99 54.27,12.99 54.57,13.3 55.7,13.3 56.81,14.4 U12.18
LCD_DB0: length 86.9
  Top Layer w0.203: v1(49.02,33.88) 49,33.86 U4.61 49.02,32.43 49.02,29.39 52.96,25.45 91.57,25.45 92.68,24.34 92.68,24.32 93.29,23.71 93.31,23.71 93.34,23.67 95.18,23.67 H3.36 ; v1(41.91,29.64) 41.91,27.96 51.56,18.31 51.56,13 U12.15
  Bottom Layer w0.203: v1(41.91,29.64) 41.91,31.67 44.12,33.88 v1(49.02,33.88)
LCD_DB1: length 74.5
  Top Layer w0.203: v1(52.71,33.91) 49.86,33.91 49.5,33.55 U4.62 49.53,32.42 49.53,29.51 53.23,25.81 92.55,25.81 93.6,24.76 H3.35
  Bottom Layer w0.203: U12.21 50.16,25.83 53.09,28.75 53.09,33.58 52.76,33.91 v1(52.71,33.91)
LCD_DB2: length 86.2
  Top Layer w0.203: v1(64.06,31.83) 62.31,33.58 56.75,33.58 56.01,34.32 56.01,36.3 56.21,36.5 U4.81 65.53,36.5 72.34,43.31 72.34,43.74 72.39,43.79 72.39,44.5 72.97,45.08 H3.19
  Bottom Layer w0.203: v1(64.06,31.83) 64.06,30.2 62.28,28.42 62.28,28.37 59.69,25.78 59.69,11.61 58.17,10.08 51.69,10.08 50.16,11.61 U12.14
LCD_DB3: length 73.6
  Top Layer w0.203: U12.22 47.62,20.5 v1(46.86,21.26) ; v1(53.85,36.88) 53.97,37 U4.82 57.56,37.01 65.28,37.01 71.88,43.61 71.88,45.39 72.9,46.41 95,46.41 96.21,47.62 H3.18
  Bottom Layer w0.203: v1(53.85,36.88) 52.32,35.36 52.32,34.85 46.86,29.39 v1(46.86,21.26)
LCD_DB4: length 116.2
  Top Layer w0.203: U4.38 42.41,39.96 35.46,39.96 19.21,23.71 6,23.71 5.97,23.67 4.82,23.67 H2.35 1.76,22.79 1.76,11.24 3.25,9.75 7.49,9.75 8.74,11 13,11 14.16,12.16 14.16,15.02 14.7,15.57 25.5,15.57 26.03,15.04 26.03,11.53 27.86,9.7 45.47,9.7 U12.13
LCD_DB5: length 80.5
  Top Layer w0.203: H2.38 6.34,22.15 18.29,22.15 35.69,39.55 42.4,39.55 U4.39 42.53,39.42 v1(45.85,39.42) ; v1(45.85,22.53) 45.85,20.15 45.31,19.62 45.31,17.62 45.85,17.09 45.85,15.16 U12.23
  Bottom Layer w0.203: v1(45.85,39.42) 51.05,39.42 51.69,38.79 51.69,34.98 46.23,29.51 46.23,22.91 v1(45.85,22.53)
LCD_DB6: length 111.3
  Top Layer w0.203: U4.40 35.77,39 17.65,20.88 5.07,20.88 H2.37 2.07,20.56 2.07,11.37 3.38,10.06 7.36,10.06 8.61,11.31 12.88,11.31 13.82,12.25 13.82,15.12 14.58,15.88 27.86,15.88 28.57,15.16 28.57,11.35 29.84,10.08 43.31,10.08 U12.12
LCD_DB7: length 85.2
  Top Layer w0.203: v1(28.32,19.99) 40.77,19.99 42.54,18.21 42.54,14.4 ; v1(12.06,19.35) 6.59,19.35 H2.40 6.83,20.24 17.65,20.24 35.94,38.53 42.42,38.53 U4.41
  Bottom Layer w0.203: v1(12.06,19.35) 18.67,19.35 19.3,19.99 v1(28.32,19.99)
LCD_DB8: length 106
  Top Layer w0.203: 42.54,11.86 41.57,11.86 40.16,10.45 32.14,10.45 31.24,11.35 31.24,14.78 29.84,16.18 14.45,16.18 13.49,15.22 13.51,15.2 13.51,12.38 12.75,11.61 8.48,11.61 7.24,10.36 3.51,10.36 2.37,11.5 2.37,17.27 3.73,18.63 H2.39 5.2,18.21 13.03,18.21 14.05,19.23 18.69,19.23 37.49,38.02 42.43,38.02 U4.42
LCD_DB9: length 85.4
  Top Layer w0.203: U4.43 42.43,37.52 37.41,37.52 18.75,18.85 14.1,18.85 11.69,16.43 6.98,16.43 H2.42 6.33,17.2 v1(11.3,17.2) ; U12.25 40.26,14.4 41.53,15.67 41.53,17.91 41.45,17.83 v1(26.92,17.83)
  Bottom Layer w0.203: v1(11.3,17.2) 14.86,17.2 15.88,18.21 21.72,18.21 21.74,18.19 22.41,18.19 22.76,17.83 v1(26.92,17.83)
LCD_DB10: length 100.9
  Top Layer w0.203: U4.44 42.44,37.01 37.34,37.01 18.8,18.47 14.15,18.47 11.35,15.67 5.2,15.67 H2.41 3.73,16.09 2.68,15.04 2.68,11.62 3.63,10.67 7.11,10.67 8.36,11.91 12.62,11.91 13.17,12.47 13.17,15.07 13.17,15.08 13.17,15.33 14.4,16.56 32.26,16.56 33.53,15.29 33.53,11.7 34.47,10.76 38.9,10.76 U12.10
LCD_DB11: length 77.6
  Top Layer w0.203: H2.44 10.71,14.6 14.2,18.09 19.13,18.09 37.54,36.5 U4.45 44.42,36.5 v1(44.73,36.81)
  Bottom Layer w0.203: U12.26 37.08,14.78 37.08,36.25 37.72,36.88 44.65,36.88 v1(44.73,36.81)
LCD_DB12: length 81.7
  Top Layer w0.203: U12.9 38.44,11.86 39.88,13.3 43,13.3 43.65,13.94 43.65,13.98 43.94,14.28 43.94,23.8 41.02,26.72 41.02,31.19 44.3,34.47 44.3,35.38 43.68,36 U4.46 42.44,35.99 37.47,35.99 19.18,17.7 14.25,17.7 10.09,13.55 4.78,13.55 H2.43
LCD_DB13: length 100.1
  Top Layer w0.203: H3.42 95.18,16.05 93.09,16.05 90.81,18.34 90.81,21.64 89.28,23.16 51.44,23.16 45.97,28.63 45.97,32.42 U4.55 45.97,32.48 45.97,34.21 46.35,34.59 46.35,37.14 v1(46.53,37.31)
  Bottom Layer w0.203: v1(46.53,37.31) 46.35,37.49 45.59,37.49 45.56,37.52 37.54,37.52 36.45,36.42 36.45,15.93 U12.27
LCD_DB14: length 91.2
  Top Layer w0.203: v1(47.12,35.2) 47.12,34.72 46.48,34.09 46.48,32.47 U4.56 46.48,32.43 46.48,28.75 51.69,23.55 89.53,23.55 91.19,21.9 91.19,19.68 H3.41 ; U12.8 36.19,13.13 36.19,15.29 37.72,16.81 v1(37.72,16.94)
  Bottom Layer w0.203: v1(37.72,16.94) 37.72,28.12 41.53,31.93 41.53,34.34 42.39,35.2 v1(47.12,35.2)
LCD_DB15: length 102.1
  Top Layer w0.203: H3.40 95.18,18.59 93.22,18.59 91.69,20.12 91.69,22.02 89.79,23.93 51.94,23.93 46.99,28.88 46.99,32.44 U4.57 47,33.97 48.36,35.33 v1(48.36,37.8)
  Bottom Layer w0.203: v1(48.36,37.8) 48.13,38.02 37.62,38.02 37.39,37.8 36.55,37.8 35.81,37.06 35.81,17.2 33.02,14.4 U12.28
LCD_RD: length 87.2
  Top Layer w0.203: v1(63.4,31.29) 61.49,33.2 56.7,33.2 53.65,36.25 52.96,36.25 52.32,36.88 52.32,37.52 52.96,38.15 54.99,38.15 55.34,38.5 U4.85 57.59,38.46 64.82,38.46 70.74,44.37 70.74,49.2 71.7,50.16 H3.15
  Bottom Layer w0.203: U12.16 56.68,13.3 58.24,13.3 58.89,13.94 58.89,15.51 58.93,15.54 58.93,25.45 61.98,28.5 61.98,28.55 63.4,29.97 v1(63.4,31.29)
LCD_RS: length 99.6
  Top Layer w0.203: v1(79.35,20.96) 79.3,21.01 60.05,21.01 59.28,20.24 59.28,13.36 U12.17 ; U4.58 47.5,32.45 47.5,29.01 52.2,24.31 90.17,24.31 92.2,22.28 92.2,20.88 93.4,19.68 H3.39
  Bottom Layer w0.203: H3.39 92.46,20.96 90.37,20.96 89.23,19.81 86.38,19.81 85.24,20.96 v1(79.35,20.96)
LCD_RST: length 92.4
  Top Layer w0.203: v1(54.74,40.56) 53.85,41.45 53.85,42.02 56.83,45 U4.98 57.59,44.96 63.58,44.96 66.17,47.55 66.17,65.2 66.37,65.4 H3.3
  Bottom Layer w0.203: U12.20 58.29,19.99 58.29,38.15 55.88,40.56 v1(54.74,40.56)
LCD_WR: length 83.4
  Top Layer w0.203: v1(54.74,39.04) 54.78,39 U4.86 57.59,38.96 64.69,38.96 70.36,44.63 70.36,49.96 72.01,51.61 95.12,51.61 96.21,52.7 H3.14
  Bottom Layer w0.203: U12.19 54.14,13.3 52.25,13.3 51.6,13.94 51.6,14.86 57.4,20.66 57.4,36.37 v1(54.74,39.04)
MOTOR_IN1: length 110.2
  Top Layer w0.203: 47.26,45.76 48,46.5 U4.17 ; v1(50.04,8.18) v1(55.25,8.18)
  Bottom Layer w0.203: v1(50.04,8.18) 51.56,6.66 H5.1 ; H2.22 40.23,42.54 43.89,46.2 46.71,46.2 47.04,45.88 47.04,45.86 v1(47.26,45.64) 47.04,45.43 47.04,45.41 46.75,45.12 46.75,44.82 49.07,42.5 49.07,41.35 49.3,41.12 55.05,41.12 55.28,40.9 58.9,40.9 65.91,33.89 65.91,28.55 61.21,23.86 61.21,12.37 57.81,8.97 56.03,8.97 v1(55.25,8.18)
MOTOR_IN2: length 137.9
  Top Layer w0.203: v1(2.92,6.78) 4.7,6.78 7.49,3.99 v1(7.49,3.1) ; H2.21 1.52,40.33 1.52,37.06 v1(1.09,36.63) ; v1(36.07,1.7) v1(26.8,1.7) ; v1(21.34,1.57) v1(10.29,1.57) ; v1(47.12,1.96) v1(43.31,1.96) ; 46.48,45.77 46.59,45.77 47.5,46.68 U4.18
  Bottom Layer w0.203: H2.21 5.07,41.2 7.49,41.2 8.51,42.22 40.51,42.22 43.94,45.64 v1(46.48,45.64) ; H5.2 49.02,3.86 v1(47.12,1.96) ; v1(10.29,1.57) 9.02,1.57 v1(7.49,3.1) ; v1(2.92,6.78) 2.73,6.97 2.73,8.19 1.09,9.83 v1(1.09,36.63) ; v1(21.34,1.57) 22.48,2.72 25.53,2.72 26.54,1.7 v1(26.8,1.7) ; v1(36.07,1.7) 36.32,1.96 40.07,1.96 41.14,3.03 42.37,3.03 42.7,2.7 42.7,2.57 v1(43.31,1.96)
MOTOR_IN3: length 208.9
  Top Layer w0.203: H2.32 22.17,29.84 34.8,42.47 42.42,42.47 U4.33 46.07,42.5 46.86,41.71 46.86,39.04 45.72,37.9 45.72,35.39 43.18,32.85 v1(43.18,27.48) ; v1(14.36,40.3) 18.29,44.22 18.29,60.12 21.59,63.42 48.64,63.42 53.21,68 53.21,81.74 56.29,84.81 66.74,84.81 SW2.1 67.08,89.41 67.08,94.94 68.52,96.38 SW2.2 ; v1(42.29,8.38) 45.14,8.38 v1(45.47,8.05)
  Bottom Layer w0.203: H2.32 9.72,29.84 12.06,32.18 12.06,40.06 13.08,41.07 13.59,41.07 v1(14.36,40.3) ; v1(43.18,27.48) 43.65,27.01 43.65,9.74 v1(42.29,8.38) ; H5.3 46.48,7.04 v1(45.47,8.05)
MOTOR_IN4: length 272.5
  Top Layer w0.203: v1(24.38,39.91) 21.95,42.35 21.95,61.37 23.24,62.66 48.9,62.66 53.97,67.74 53.97,81.46 56.62,84.1 78.98,84.1 SW3.1 80.03,89.41 C19.2 80.03,94.41 82,96.38 SW3.2 ; v1(44.96,41.58) 44.58,41.96 42.49,41.96 U4.34 42.41,41.96 34.93,41.96 21.59,28.63 4.94,28.63 H2.31 ; v1(17.65,2.34) v1(12.83,2.34)
  Bottom Layer w0.203: H2.31 2.46,29.84 2.15,30.15 2.15,35.45 2.98,36.28 4.04,36.28 4.78,37.02 4.78,37.9 4.17,38.51 3.29,38.51 2.66,37.88 2.66,36.82 1.4,35.56 1.4,10.08 9.14,2.34 v1(12.83,2.34) ; v1(44.96,41.58) 43.66,40.28 36.25,40.28 35.87,39.91 v1(24.38,39.91) ; v1(17.65,2.34) 21.59,2.34 22.35,3.1 40.63,3.1 40.87,3.33 44.56,3.33 44.96,3.73 44.96,4.22 H5.4
OSCH1: length 12.2
  Top Layer w0.203: U4.12 50.4,47.65 50.4,49.55 49.63,50.32 49.38,50.32 48.87,50.83 47.35,50.83 46.38,51.79 46.38,53.52 46.98,54.11 X1.3 49.61,54.11 C14.2
OSCH2: length 10.2
  Top Layer w0.203: C13.1 43.04,52.41 X1.1 45.33,52.41 47.22,50.52 48.75,50.52 49.25,50.01 49.51,50.01 50,49.52 U4.13
OSCL1: length 10.7
  Top Layer w0.203: U4.8 52.5,49.25 52.83,49.58 56.9,49.58 57.66,50.34 57.66,51.53 X2.2 57.74,53.66 C15.2
OSCL2: length 9.1
  Top Layer w0.203: U4.9 52,49.64 52.32,49.96 54.86,49.96 55.25,50.34 55.25,51.56 55.19,51.61 55.25,51.68 C16.2
PA2: length 108.4
  Top Layer w0.203: U16.5 11.94,5.26 v1(10.03,7.16) ; v1(13.98,11.19) 14.86,12.07 v1(14.86,14.66) ; U4.25 36.07,47.55 25.98,37.46 H2.26 ; v1(21.34,39.67) 13.08,39.67 11.84,40.92 v1(10.74,40.92) ; v1(22.48,17.32) 24.77,17.32 27.18,19.74 v1(27.18,22.28)
  Bottom Layer w0.203: H2.26 9.73,40.92 v1(10.74,40.92) ; v1(14.86,14.66) 18.08,17.88 21.92,17.88 v1(22.48,17.32) ; v1(21.34,39.67) 21.97,39.04 21.97,27.48 v1(27.18,22.28) ; v1(13.98,11.19) 10.03,7.24 v1(10.03,7.16)
PA3: length 86.6
  Top Layer w0.203: H2.25 4.78,36.41 25.56,36.41 36.32,47.17 41.4,47.17 42.45,46.12 U4.26
  Bottom Layer w0.203: H2.25 1.78,35.51 1.78,10.85 6.22,6.4 13.28,6.4 U16.4
PA4: length 86.1
  Top Layer w0.203: U4.29 34.29,44.5 24.71,34.92 H2.28 ; v1(11.81,14.4) 10.65,13.24 5.84,13.24 5.48,12.88 v1(5.21,12.88)
  Bottom Layer w0.203: v1(5.21,12.88) 5.21,14.15 5.22,14.16 5.22,33.87 H2.28 ; U16.2 18.58,5.21 17.47,4.1 16.56,4.1 15.91,4.75 15.91,11.19 13.72,13.39 12.83,13.39 v1(11.81,14.4)
PA5: length 169.7
  Top Layer w0.203: U13.7 86.18,3.1 21.72,3.1 20.95,3.86 20.95,6.12 21.14,6.31 21.63,6.31 22.22,6.91 22.22,9.65 v1(22.1,9.78) ; v1(25.02,21.77) 24.72,21.77 20.57,17.62 v1(20.57,17.32) ; v1(17.78,35.61) 17.4,35.99 4.8,35.99 H2.27 5.07,33.58 24,33.58 34.42,44 U4.30
  Bottom Layer w0.203: v1(22.1,9.78) 19.23,9.78 U12.1 18.42,13.13 18.42,15.16 v1(20.57,17.32) ; v1(25.02,21.77) 17.78,29.01 v1(17.78,35.61)
PA6: length 165.5
  Top Layer w0.203: 23.33,12.32 23.33,13.3 22.22,14.4 22.22,13.42 23.33,12.32 ; 23.33,12.32 23.33,11.41 22.68,10.76 20.87,10.76 20.37,10.26 8.86,10.26 7.74,9.14 3,9.14 1.15,10.99 1.15,31.29 3.29,33.43 4.17,33.43 5.44,32.16 6.05,32.16 H2.30 6.34,32.31 23.37,32.31 34.54,43.48 42.44,43.48 U4.31 ; v1(27.58,7.15) 26.84,6.41 25.01,6.41 23.11,8.31 23.11,11.19 ; U13.5 81.61,3.61 58.17,3.61 57.28,4.5 57.28,6.63 57.07,6.83 33.16,6.83 v1(32.88,7.11)
  Bottom Layer w0.203: v1(27.58,7.15) 27.62,7.15 27.97,6.79 31.94,6.79 32.11,6.96 32.72,6.96 v1(32.88,7.11)
PA7: length 159.5
  Top Layer w0.203: 22.22,11.86 21.46,11.86 20.17,10.57 8.74,10.57 7.62,9.45 3.13,9.45 1.46,11.12 1.46,23.35 2.54,24.44 2.54,31.17 3.73,32.36 H2.29 5.07,31.04 22.73,31.04 34.67,42.98 42.43,42.98 U4.32 ; v1(23.75,10.08) 27.05,10.08 27.76,9.37 60.76,9.37 v1(61.47,10.08)
  Bottom Layer w0.203: v1(61.47,10.08) 74.93,10.08 76.84,8.18 76.84,4.37 77.47,3.73 84.28,3.73 U13.6 ; 22.22,11.86 23.75,10.34 v1(23.75,10.08)
PA8: length 49.3
  Top Layer w0.203: H3.30 95.06,31.17 68.33,31.17 65.09,27.93 54.29,27.93 52,30.22 U4.67
PA9: length 147.4
  Top Layer w0.203: U14.3 28.96,81.2 29.84,80.31 29.84,77.27 31.5,75.62 v1(37.34,75.62) ; H3.29 68.78,32.38 64.77,28.37 54.48,28.37 52.45,30.4 52.45,32.4 U4.68
  Bottom Layer w0.203: v1(37.34,75.62) 37.74,76.02 42.95,76.02 44.07,77.14 54.1,77.14 55.22,76.02 55.53,76.02 70.54,61.01 84.46,61.01 88.77,56.69 88.77,37.34 H3.29
PA10: length 152.8
  Top Layer w0.203: U14.2 28.19,79.93 28.83,79.3 28.83,76.76 30.99,74.6 40.51,74.6 v1(43.05,77.14) ; U4.69 52.96,32.41 52.96,30.53 54.74,28.75 64.39,28.75 69.34,33.71 95.06,33.71 H3.28
  Bottom Layer w0.203: v1(43.05,77.14) 43.46,77.55 54.64,77.55 57.82,74.36 59.12,74.36 70.54,62.94 86.13,62.94 91.47,57.61 91.47,38.18 92.99,36.65 93.05,36.65 93.29,36.41 94.17,36.41 94.41,36.65 95.53,36.65 96.27,35.91 H3.28
PA11: length 204.5
  Top Layer w0.203: USB2.A7 36.64,93.84 36.96,94.16 37.34,94.16 37.64,93.86 USB2.B7 37.59,93.09 37.59,90.6 39.62,88.57 40.26,88.57 40.4,88.71 40.4,89.89 40.99,90.47 41.34,90.47 41.93,89.89 41.93,88.71 42.07,88.57 43.69,88.57 44.5,87.76 44.7,87.76 46.53,89.59 47.24,89.59 47.61,89.22 47.61,88.51 45.78,86.68 45.78,86.48 46.65,85.61 46.86,85.61 48.68,87.43 49.4,87.43 49.76,87.07 49.76,86.36 47.93,84.53 47.93,84.32 49.4,82.86 49.4,82.39 49.55,82.25 51.31,82.25 51.45,82.1 51.45,80.86 51.31,80.72 49.55,80.72 49.4,80.58 49.4,79.34 49.55,79.2 51.31,79.2 51.45,79.05 51.45,77.82 51.31,77.67 49.55,77.67 49.4,77.53 49.4,76.29 49.55,76.15 51.31,76.15 51.45,76.01 51.45,74.77 51.31,74.62 49.55,74.62 50.16,74.01 v1(50.16,72.57) ; H3.27 69.79,34.92 64.01,29.13 54.99,29.13 53.47,30.66 53.47,32.42 U4.70 53.4,32.55 53.4,34.35 53.2,34.55 50.62,34.55 49.94,35.23 49.94,40.29 v1(52.97,43.32)
  Bottom Layer w0.203: v1(52.97,43.32) 53.06,43.23 57.15,43.23 59.41,45.49 59.61,45.49 60.23,44.88 60.43,44.88 61.16,45.61 61.16,46.1 60.69,46.57 60.69,46.77 61.75,47.83 61.95,47.83 63,46.79 63.63,46.79 64.26,47.42 64.26,48.18 63.28,49.16 63.28,49.36 63.37,49.45 63.37,51.01 63.52,51.16 67.44,51.16 67.44,52.25 67,52.68 63.52,52.68 63.37,52.82 63.37,54.06 63.52,54.2 66.53,54.2 66.95,54.63 66.95,55.31 66.53,55.73 63.52,55.73 63.37,55.87 63.37,57.11 63.52,57.25 66.09,57.25 66.29,57.46 66.29,58.57 66.09,58.78 63.52,58.78 63.37,58.92 63.37,59.36 62.77,59.97 62.77,60.17 63.32,60.73 63.32,61.31 62.83,61.81 62.25,61.81 61.69,61.25 61.49,61.25 61.16,61.58 61.16,61.78 62.4,63.02 62.4,63.31 61.61,64.1 61.32,64.1 60.08,62.86 59.88,62.86 59,63.73 59,63.93 60.24,65.17 60.24,65.46 59.45,66.25 59.17,66.25 57.92,65.01 57.72,65.01 57,65.73 57,65.93 58.24,67.17 58.24,67.46 57.45,68.25 57.16,68.25 55.92,67.01 55.72,67.01 54.7,68.04 54.7,68.24 56.08,69.62 56.08,69.83 55.21,70.7 55,70.7 53.62,69.32 53.41,69.32 52.54,70.19 52.54,70.4 53.9,71.75 53.9,72.06 53.85,72.06 53.39,72.52 52.51,72.52 51.46,71.47 51.26,71.47 v1(50.16,72.57)
PA12: length 204.6
  Top Layer w0.203: 54.03,33.2 54.48,33.65 v1(54.48,33.71) ; v1(48.7,72.38) 48.7,81.27 42.93,87.05 38.86,87.05 36.07,89.84 ; 54,33.22 53.9,33.32 53.9,34.28 53.33,34.85 50.77,34.85 50.29,35.33 50.29,39.85 51.13,40.69 ; 54,33.22 U4.71 53.97,32.42 53.97,30.78 55.25,29.51 63.63,29.51 70.36,36.25 95.06,36.25 H3.26 ; 54,33.22 54.03,33.2 ; USB2.A6 37.14,92.18 36.83,91.87 36.32,91.87 36.14,92.05 USB2.B6 36.07,93.07 36.07,89.84 ; 36.07,89.84 34.67,88.44 33.7,88.44 ; v1(34.54,21.9) v1(34.54,26.09) ; 51.13,40.69 51.18,40.69 v1(51.82,40.06) ; 51.13,40.69 54.23,43.79 v1(54.46,43.79)
  Bottom Layer w0.203: v1(48.7,72.38) 50.55,70.54 51.56,70.54 62.87,59.23 62.87,49.58 57.07,43.79 v1(54.46,43.79) ; U16.3 20.75,8.94 22.99,8.94 23.24,9.19 23.65,9.19 24.64,10.18 24.64,10.47 24.34,10.76 24.31,10.76 23.66,11.41 23.66,11.44 23.62,11.48 23.62,12.75 23.77,12.89 24.24,12.89 24.31,12.97 25.36,12.97 26.03,13.64 26.03,15.04 27,16 28.14,16 29.97,17.83 33.53,17.83 34.54,18.85 v1(34.54,21.9) ; v1(51.82,40.06) 51.74,39.98 36.91,39.98 35.97,39.04 35.56,39.04 34.54,38.02 v1(34.54,26.09)
PA13: length 94
  Top Layer w0.203: U4.72 54.48,32.43 54.48,30.91 55.5,29.9 63.25,29.9 70.61,37.26 93.53,37.26 H3.25
  Bottom Layer w0.203: H3.25 94.78,38.51 94.78,74.56 92.33,77.01 92.33,81.71 93.47,82.86 H4.2
PA14: length 88.8
  Top Layer w0.203: U4.76 57.59,33.96 66.55,33.96 71.5,38.91 95.18,38.91 H3.24
  Bottom Layer w0.203: H3.24 96.44,40.17 97.27,40.17 98.04,40.94 98.04,83.11 H4.3
PA15: length 38.5
  Top Layer w0.203: U4.77 57.58,34.47 66.29,34.47 71.83,40 H3.23
PB0: length 144.4
  Top Layer w0.203: H2.34 6.33,27.36 20.95,27.36 35.06,41.46 42.41,41.46 U4.35 ; v1(13.35,40.3) 17.02,43.97 17.02,60.5 20.57,64.06 48.26,64.06 52.45,68.25 52.45,85.78 56.22,89.54 LED3.1
  Bottom Layer w0.203: v1(13.35,40.3) 13.35,29.78 11.81,28.25 7.22,28.25 H2.34
PB1: length 159.8
  Top Layer w0.203: H2.33 3.73,27.18 5.08,25.83 20.07,25.83 35.19,40.96 42.41,40.96 U4.36 ; LED4.1 51.82,86.41 51.82,68.5 48.01,64.69 20.22,64.69 16.26,60.73 16.26,46.81 15.98,46.53 3.05,46.53 1.65,45.14 v1(1.65,44.63)
  Bottom Layer w0.203: v1(1.65,44.63) 1.65,39.04 1.74,38.95 4.03,38.95 4.16,38.82 4.29,38.82 5.09,38.02 5.09,36.9 5.08,36.89 5.08,34.72 4.83,34.47 4.83,28.4 H2.33
PB3: length 46.9
  Top Layer w0.203: H3.11 71.19,55.24 69.22,53.26 69.22,45.39 64.28,40.46 57.59,40.46 U4.89
PB4: length 51
  Top Layer w0.203: U4.90 57.59,40.96 64.15,40.96 68.83,45.64 68.83,54.66 70.74,56.57 95.06,56.57 H3.10
PB5: length 123.4
  Top Layer w0.203: v1(56.13,94.92) 56.72,94.33 LED2.1 ; H3.9 70.05,57.78 68.58,56.31 68.58,54.84 68.53,54.79 68.53,45.85 64.18,41.5 U4.91
  Bottom Layer w0.203: v1(56.13,94.92) 54.61,94.92 53.47,93.78 53.47,86.67 59.03,81.1 87.48,81.1 90.81,77.78 90.81,60.7 H3.9
PB7: length 50.8
  Top Layer w0.203: H3.7 69.29,60.32 67.69,58.72 67.69,46.41 63.75,42.47 57.58,42.47 U4.93
PB8: length 54.8
  Top Layer w0.203: U4.95 57.56,43.48 64.01,43.48 67.31,46.79 67.31,60.5 68.58,61.77 95.18,61.77 H3.6
PB9: length 52.7
  Top Layer w0.203: U4.96 57.56,43.99 63.88,43.99 66.93,47.04 66.93,61.9 67.89,62.86 H3.5
PB12: length 68.1
  Top Layer w0.203: U4.51 43.94,32.39 43.94,28.12 50.42,21.64 88.26,21.64 89.28,20.62 89.28,17.7 91.57,15.42 91.57,13.39 92.46,12.5 92.46,11.23 92.96,10.72 94.93,10.72 H3.46
PB13: length 98.5
  Top Layer w0.203: P2.5 67.69,6.91 v1(95.12,6.91) ; U4.52 44.45,32.4 44.45,28.25 50.67,22.02 88.52,22.02 89.66,20.88 89.66,17.83 91.95,15.54 91.95,13.84 H3.45
  Bottom Layer w0.203: v1(95.12,6.91) 95.12,10.67 H3.45
PB14: length 108.7
  Top Layer w0.203: P2.3 63.25,7.54 v1(95.88,7.54) ; H3.44 95.18,13.51 93.09,13.51 92.46,14.15 92.46,15.54 90.04,17.96 90.04,21.13 88.77,22.4 50.93,22.4 44.96,28.37 44.96,32.41 U4.53
  Bottom Layer w0.203: v1(95.88,7.54) 97.41,9.07 97.41,13.46 H3.44
PB15: length 93.2
  Top Layer w0.203: P2.6 69.72,6.4 72.25,6.4 72.26,6.41 91.39,6.41 91.4,6.4 91.9,6.4 v1(91.95,6.35) ; H3.43 93.73,14.78 90.42,18.09 90.42,21.39 89.03,22.78 51.18,22.78 45.47,28.5 45.47,32.42 U4.54
  Bottom Layer w0.203: H3.43 91.57,12.44 91.57,10.21 91.95,9.83 v1(91.95,6.35)
PC0: length 45.8
  Top Layer w0.203: U4.15 v1(49,45.64)
  Bottom Layer w0.203: H2.20 41.9,45.08 43.64,46.81 47.83,46.81 v1(49,45.64)
PC1: length 48.4
  Top Layer w0.203: 48.02,45.77 48.51,46.27 48.51,47.54 U4.16
  Bottom Layer w0.203: v1(48.02,45.64) 47.82,45.85 47.82,45.88 47.49,46.2 47.46,46.2 47.16,46.51 43.76,46.51 41,43.74 5.07,43.74 H2.19
PC6: length 111.3
  Top Layer w0.203: U4.63 50,29.68 53.43,26.25 93.17,26.25 93.29,26.12 95.09,26.12 H3.34 ; v1(97.79,8.31) 61.47,8.31 P2.2
  Bottom Layer w0.203: H3.34 96.27,27.1 97.79,25.58 v1(97.79,8.31)
PC7: length 75.6
  Top Layer w0.203: v1(87.63,20.37) 87.63,17.96 90.42,15.16 v1(90.42,13.13) ; U4.64 50.5,29.81 53.59,26.72 66.17,26.72 66.75,27.3 H3.33
  Bottom Layer w0.203: U13.8 90.93,12.62 v1(90.42,13.13) ; H3.33 89.73,27.3 87.63,25.2 v1(87.63,20.37)
PC8: length 99.6
  Top Layer w0.203: H3.32 96.27,29.77 95,28.5 67.18,28.5 65.79,27.1 53.85,27.1 51,29.95 U4.65
  Bottom Layer w0.203: U13.2 75.69,3.73 76.07,3.35 90.81,3.35 93.73,6.27 95.5,6.27 96.9,7.67 97.92,7.67 97.99,7.75 98.02,7.75 98.35,8.07 98.35,8.1 98.68,8.43 98.68,27.86 96.7,29.84 H3.32
PC9: length 80.9
  Top Layer w0.203: U4.66 51.5,29.96 54.05,27.41 65.46,27.41 67.76,29.71 93.6,29.71 H3.31
  Bottom Layer w0.203: H3.31 95,28.57 95,20.37 94.78,20.16 94.78,19.24 94.17,18.63 93.25,18.63 89.03,14.4 89.03,9.02 88.82,8.81 84.28,8.81 U13.4
PC10: length 41.9
  Top Layer w0.203: H3.22 95.06,41.33 72.39,41.33 66.04,34.98 57.57,34.98 U4.78
PC11: length 39.1
  Top Layer w0.203: U4.79 57.57,35.48 65.79,35.48 72.84,42.54 H3.21
PC12: length 42.8
  Top Layer w0.203: U4.80 57.56,35.99 65.53,35.99 72.64,43.1 72.64,43.61 73.03,43.99 95.18,43.99 H3.20
PC13: length 52.2
  Top Layer w0.203: v1(51.15,45.39) 51.15,45.74 51.91,46.5 52.67,46.5 53,46.83 U4.7
  Bottom Layer w0.203: v1(51.15,45.39) 50.66,45.88 50.6,45.88 50.27,46.2 48.87,46.2 47.96,47.12 43.51,47.12 42.96,46.57 4.78,46.57 H2.17
PD2: length 42
  Top Layer w0.203: U4.83 57.57,37.52 65.15,37.52 71.5,43.87 71.5,46.66 72.46,47.62 H3.17
PD3: length 46.1
  Top Layer w0.203: U4.84 57.57,38.02 65.02,38.02 71.12,44.12 71.12,48.06 72.14,49.07 95.18,49.07 H3.16
PD6: length 45.1
  Top Layer w0.203: H3.13 71.95,52.7 69.98,50.72 69.98,44.88 64.56,39.46 57.59,39.46 U4.87
PD13: length 51.3
  Top Layer w0.203: H3.37 90.88,25.07 52.71,25.07 48.5,29.28 U4.60
PE0: length 57
  Top Layer w0.203: H3.4 95.7,65.4 94.49,64.19 67.06,64.19 66.55,63.68 66.55,47.3 63.75,44.5 U4.97
PE2: length 116.9
  Top Layer w0.203: v1(19.3,49.83) 19.3,40.49 v1(19.05,40.23) ; U4.1 56.25,47.55 v1(56.88,46.93) ; v1(24.2,19.3) 25.15,20.24 v1(25.15,20.75)
  Bottom Layer w0.203: v1(19.3,49.83) 16.44,52.7 H2.14 10.33,48.64 48.59,48.64 49.5,47.73 53.54,47.73 54.34,46.93 v1(56.88,46.93) ; v1(25.15,20.75) 25.91,21.51 25.91,21.77 18.54,29.13 18.54,39.73 v1(19.05,40.23) ; U12.33 20.32,14.4 22.68,16.76 22.71,16.76 22.76,16.81 26.92,16.81 27.56,17.45 27.56,18.59 27.42,18.74 24.77,18.74 v1(24.2,19.3)
PE3: length 128
  Top Layer w0.203: v1(26.54,20.75) 25.27,19.48 v1(25.27,19.35) ; U4.2 55.5,45.93 55.07,45.49 v1(55.07,45.34) ; v1(20.57,50.09) 20.57,40.61 v1(20.19,40.23)
  Bottom Layer w0.203: U12.2 19.69,11.99 20.83,13.13 22.99,13.13 23.66,13.81 23.66,14.86 23.73,14.93 23.73,16.16 23.88,16.31 27.43,16.31 28.32,17.2 28.32,18.97 27.94,19.35 v1(25.27,19.35) ; v1(55.07,45.34) 54.75,45.34 52.67,47.42 49.38,47.42 48.46,48.34 9.12,48.34 7.62,49.83 7.62,50.72 6.98,51.36 5.07,51.36 H2.13 4.78,53.75 16.91,53.75 v1(20.57,50.09) ; v1(20.19,40.23) 19.43,39.47 19.43,29.51 26.54,22.4 v1(26.54,20.75)
PE4: length 52.3
  Top Layer w0.203: U4.3 54.99,47.54 54.99,46.41 53.94,45.36
  Bottom Layer w0.203: v1(53.94,45.36) 53.72,45.36 51.96,47.12 49.25,47.12 48.34,48.03 8.4,48.03 H2.16
PE5: length 54.1
  Top Layer w0.203: U4.4 54.5,46.71 53.18,45.39 v1(52.9,45.39)
  Bottom Layer w0.203: v1(52.9,45.39) 52.86,45.39 51.44,46.81 49.13,46.81 48.21,47.73 8.08,47.73 6.98,48.82 5.07,48.82 H2.15
PE6: length 50
  Top Layer w0.203: v1(51.99,45.39) 53.1,46.5 53.67,46.5 54,46.83 U4.5
  Bottom Layer w0.203: v1(51.99,45.39) 51.97,45.39 50.85,46.51 49,46.51 48.08,47.42 6.47,47.42 H2.18
RST: length 70.5
  Top Layer w0.203: 30.42,58.6 30.42,56.53 ; 30.42,56.53 26.56,56.53 ; 30.42,56.53 35.66,56.53 ; U4.14 49.5,48.34 48.51,49.33 46.72,49.33 45.43,50.62 40.74,50.62 39.69,51.67 39.69,54.9 39.49,55.1 R7.2 36.87,56.53 35.66,56.53 ; 35.66,56.53 35.66,60.53 v1(34.67,61.52) ; v1(38.54,85.2) 40.03,85.2 40.09,85.27
  Bottom Layer w0.203: v1(34.67,61.52) 34.67,74.93 36.07,76.33 40.94,76.33 42.37,77.75 42.37,83.39 42.22,83.53 40.22,83.53 v1(38.54,85.2)
RTS: length 23.6
  Top Layer w0.203: R22.1 41.78,83.49 41.53,83.74 34.16,83.74 33.77,83.35 Q1.2 33.77,82.33 v1(33.02,81.58) ; U14.14 v1(22.99,81.2)
  Bottom Layer w0.203: v1(22.99,81.2) 32.64,81.2 v1(33.02,81.58)
USB+5V:
  vias: v1(20.57,92.02) v1(20.57,91.27) v1(23.11,91.11) v1(25.37,92.02) v1(25.37,91.32) v1(34.48,92.02) v1(34.48,91.32) v1(39.28,92.02) v1(39.28,91.32)
$1N1484: length 7.6
  Top Layer w0.762: 61.62,74.1 61.62,73.31 62.23,72.69 64.67,72.69 BT1.2
$1N1488: length 54.4
  Top Layer w0.381: U4.6 53.49,47.56 53.49,48.47 53.87,48.84 56.24,48.84 57.68,47.4 58.32,47.4 60.6,49.68 60.6,56.54 59.72,57.43 51.65,57.43 C11.1
  Top Layer w0.762: D1.3 63.59,74.97 60.81,74.97 59.38,73.54 59.38,59.67 57.91,58.19 51.34,58.19 C11.1
